# Altium project MC-IMX6Q-BOARD.PrjPCB
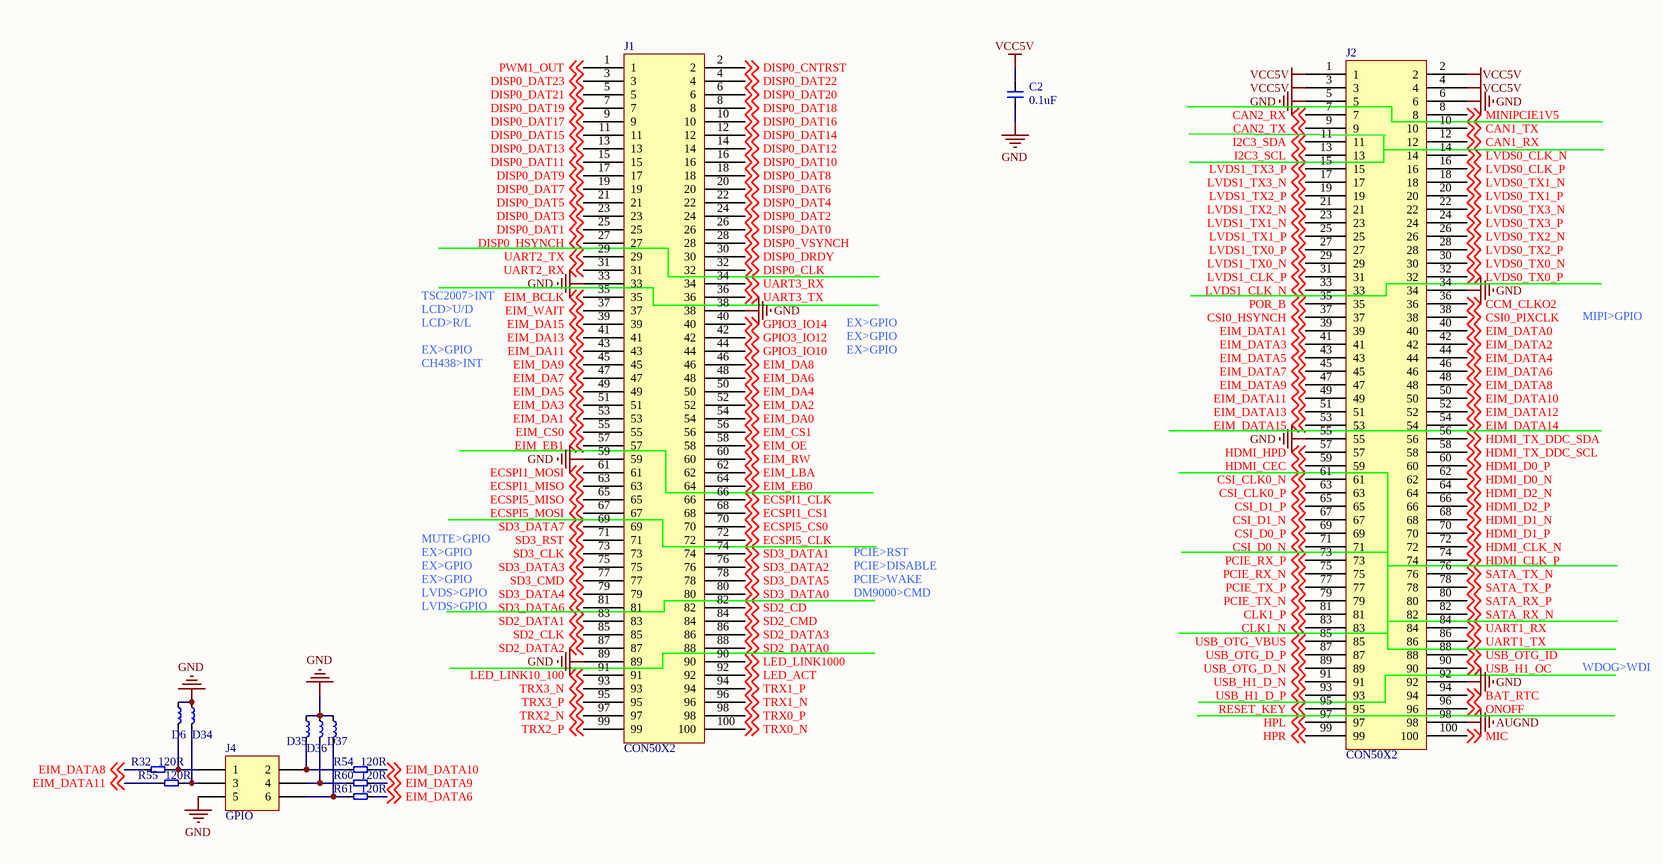
[diagram p0: 0.CONNECTOR.SchDoc]
10 sheets, 287 parts. Net scope: global (net labels, ports and power ports of the same name join across sheets).
Board file: IMX6.PcbDoc
Sheets:
  0.CONNECTOR.SchDoc
  1.POWER.SchDoc
  2.ETH.SchDoc
  3.UART.SchDoc
  4.CAN.SchDoc
  5.USB.SchDoc
  7.MINIPCIE.SchDoc
  10.LVDS.SchDoc
  11.EX-MODULE.SchDoc
  12.WTD&RTC.SchDoc

## Sheet 0.CONNECTOR.SchDoc
size A3

### Parts
(Parts that share a designator on the sheet are numbered #1, #2 ... from top to bottom, then left to right.)
C2  0.1uF  [0603C]
D6#1  ESD  [0603L]  (value not drawn)
D34  ESD  [0603L]  (value not drawn)
D35  ESD  [0603L]  (value not drawn)
D36  ESD  [0603L]  (value not drawn)
D37  ESD  [0603L]  (value not drawn)
J1  CON50X2  [IDC50X2-1.27MM_SMT]
J2  CON50X2  [IDC50X2-1.27MM_SMT]
J4  GPIO  [5557-6-small]
R32#1  120R  [0603R]
R54#1  120R  [0603R]
R55#1  120R  [0603R]
R60  120R  [0603R]
R61  120R  [0603R]

### Nets
AUGND: J2.98
GND: C2.2 D6#1.1 D34.1 D35.1 D36.1 D37.1 J1.33 J1.38 J1.59 J1.89 J2.5 J2.6 J2.34 J2.55 J2.92 J4.5
VCC5V: C2.1 J2.1 J2.2 J2.3 J2.4
BAT_RTC: J2.94 ; off-sheet BAT_RTC
CAN1_RX: J2.12 ; off-sheet CAN1_RX
CAN1_TX: J2.10 ; off-sheet CAN1_TX
CAN2_RX: J2.7 ; off-sheet CAN2_RX
CAN2_TX: J2.9 ; off-sheet CAN2_TX
CCM_CLKO2: J2.36 ; off-sheet CCM_CLKO2
CLK1_N: J2.83 ; off-sheet CLK1_N
CLK1_P: J2.81 ; off-sheet CLK1_P
CSI0_HSYNCH: J2.37 ; off-sheet CSI0_HSYNCH
CSI0_PIXCLK: J2.38 ; off-sheet CSI0_PIXCLK
CSI_CLK0_N: J2.61 ; off-sheet CSI_CLK0_N
CSI_CLK0_P: J2.63 ; off-sheet CSI_CLK0_P
CSI_D0_N: J2.71 ; off-sheet CSI_D0_N
CSI_D0_P: J2.69 ; off-sheet CSI_D0_P
CSI_D1_N: J2.67 ; off-sheet CSI_D1_N
CSI_D1_P: J2.65 ; off-sheet CSI_D1_P
DISP0_CLK: J1.32 ; off-sheet DISP0_CLK
DISP0_CNTRST: J1.2 ; off-sheet DISP0_CNTRST
DISP0_DAT0: J1.26 ; off-sheet DISP0_DAT0
DISP0_DAT1: J1.25 ; off-sheet DISP0_DAT1
DISP0_DAT2: J1.24 ; off-sheet DISP0_DAT2
DISP0_DAT3: J1.23 ; off-sheet DISP0_DAT3
DISP0_DAT4: J1.22 ; off-sheet DISP0_DAT4
DISP0_DAT5: J1.21 ; off-sheet DISP0_DAT5
DISP0_DAT6: J1.20 ; off-sheet DISP0_DAT6
DISP0_DAT7: J1.19 ; off-sheet DISP0_DAT7
DISP0_DAT8: J1.18 ; off-sheet DISP0_DAT8
DISP0_DAT9: J1.17 ; off-sheet DISP0_DAT9
DISP0_DAT10: J1.16 ; off-sheet DISP0_DAT10
DISP0_DAT11: J1.15 ; off-sheet DISP0_DAT11
DISP0_DAT12: J1.14 ; off-sheet DISP0_DAT12
DISP0_DAT13: J1.13 ; off-sheet DISP0_DAT13
DISP0_DAT14: J1.12 ; off-sheet DISP0_DAT14
DISP0_DAT15: J1.11 ; off-sheet DISP0_DAT15
DISP0_DAT16: J1.10 ; off-sheet DISP0_DAT16
DISP0_DAT17: J1.9 ; off-sheet DISP0_DAT17
DISP0_DAT18: J1.8 ; off-sheet DISP0_DAT18
DISP0_DAT19: J1.7 ; off-sheet DISP0_DAT19
DISP0_DAT20: J1.6 ; off-sheet DISP0_DAT20
DISP0_DAT21: J1.5 ; off-sheet DISP0_DAT21
DISP0_DAT22: J1.4 ; off-sheet DISP0_DAT22
DISP0_DAT23: J1.3 ; off-sheet DISP0_DAT23
DISP0_DRDY: J1.30 ; off-sheet DISP0_DRDY
DISP0_HSYNCH: J1.27 ; off-sheet DISP0_HSYNCH
DISP0_VSYNCH: J1.28 ; off-sheet DISP0_VSYNCH
ECSPI1_CLK: J1.66 ; off-sheet ECSPI1_CLK
ECSPI1_CS1: J1.68 ; off-sheet ECSPI1_CS1
ECSPI1_MISO: J1.63 ; off-sheet ECSPI1_MISO
ECSPI1_MOSI: J1.61 ; off-sheet ECSPI1_MOSI
ECSPI5_CLK: J1.72 ; off-sheet ECSPI5_CLK
ECSPI5_CS0: J1.70 ; off-sheet ECSPI5_CS0
ECSPI5_MISO: J1.65 ; off-sheet ECSPI5_MISO
ECSPI5_MOSI: J1.67 ; off-sheet ECSPI5_MOSI
EIM_BCLK: J1.35 ; off-sheet EIM_BCLK
EIM_CS0: J1.55 ; off-sheet EIM_CS0
EIM_CS1: J1.56 ; off-sheet EIM_CS1
EIM_DA0: J1.54 ; off-sheet EIM_DA0
EIM_DA1: J1.53 ; off-sheet EIM_DA1
EIM_DA2: J1.52 ; off-sheet EIM_DA2
EIM_DA3: J1.51 ; off-sheet EIM_DA3
EIM_DA4: J1.50 ; off-sheet EIM_DA4
EIM_DA5: J1.49 ; off-sheet EIM_DA5
EIM_DA6: J1.48 ; off-sheet EIM_DA6
EIM_DA7: J1.47 ; off-sheet EIM_DA7
EIM_DA8: J1.46 ; off-sheet EIM_DA8
EIM_DA9: J1.45 ; off-sheet EIM_DA9
EIM_DA11: J1.43 ; off-sheet EIM_DA11
EIM_DA13: J1.41 ; off-sheet EIM_DA13
EIM_DA15: J1.39 ; off-sheet EIM_DA15
EIM_DATA0: J2.40 ; off-sheet EIM_DATA0
EIM_DATA1: J2.39 ; off-sheet EIM_DATA1
EIM_DATA2: J2.42 ; off-sheet EIM_DATA2
EIM_DATA3: J2.41 ; off-sheet EIM_DATA3
EIM_DATA4: J2.44 ; off-sheet EIM_DATA4
EIM_DATA5: J2.43 ; off-sheet EIM_DATA5
EIM_DATA6: J2.46 R61.1 ; off-sheet EIM_DATA6
EIM_DATA7: J2.45 ; off-sheet EIM_DATA7
EIM_DATA8: J2.48 R32#1.2 ; off-sheet EIM_DATA8
EIM_DATA9: J2.47 R60.1 ; off-sheet EIM_DATA9
EIM_DATA10: J2.50 R54#1.1 ; off-sheet EIM_DATA10
EIM_DATA11: J2.49 R55#1.2 ; off-sheet EIM_DATA11
EIM_DATA12: J2.52 ; off-sheet EIM_DATA12
EIM_DATA13: J2.51 ; off-sheet EIM_DATA13
EIM_DATA14: J2.54 ; off-sheet EIM_DATA14
EIM_DATA15: J2.53 ; off-sheet EIM_DATA15
EIM_EB0: J1.64 ; off-sheet EIM_EB0
EIM_EB1: J1.57 ; off-sheet EIM_EB1
EIM_LBA: J1.62 ; off-sheet EIM_LBA
EIM_OE: J1.58 ; off-sheet EIM_OE
EIM_RW: J1.60 ; off-sheet EIM_RW
EIM_WAIT: J1.37 ; off-sheet EIM_WAIT
GPIO3_IO10: J1.44 ; off-sheet GPIO3_IO10
GPIO3_IO12: J1.42 ; off-sheet GPIO3_IO12
GPIO3_IO14: J1.40 ; off-sheet GPIO3_IO14
HDMI_CEC: J2.59 ; off-sheet HDMI_CEC
HDMI_CLK_N: J2.72 ; off-sheet HDMI_CLK_N
HDMI_CLK_P: J2.74 ; off-sheet HDMI_CLK_P
HDMI_D0_N: J2.62 ; off-sheet HDMI_D0_N
HDMI_D0_P: J2.60 ; off-sheet HDMI_D0_P
HDMI_D1_N: J2.68 ; off-sheet HDMI_D1_N
HDMI_D1_P: J2.70 ; off-sheet HDMI_D1_P
HDMI_D2_N: J2.64 ; off-sheet HDMI_D2_N
HDMI_D2_P: J2.66 ; off-sheet HDMI_D2_P
HDMI_HPD: J2.57 ; off-sheet HDMI_HPD
HDMI_TX_DDC_SCL: J2.58 ; off-sheet HDMI_TX_DDC_SCL
HDMI_TX_DDC_SDA: J2.56 ; off-sheet HDMI_TX_DDC_SDA
HPL: J2.97 ; off-sheet HPL
HPR: J2.99 ; off-sheet HPR
I2C3_SCL: J2.13 ; off-sheet I2C3_SCL
I2C3_SDA: J2.11 ; off-sheet I2C3_SDA
LED_ACT: J1.92 ; off-sheet LED_ACT
LED_LINK10_100: J1.91 ; off-sheet LED_LINK10_100
LED_LINK1000: J1.90 ; off-sheet LED_LINK1000
LVDS0_CLK_N: J2.14 ; off-sheet LVDS0_CLK_N
LVDS0_CLK_P: J2.16 ; off-sheet LVDS0_CLK_P
LVDS0_TX0_N: J2.30 ; off-sheet LVDS0_TX0_N
LVDS0_TX0_P: J2.32 ; off-sheet LVDS0_TX0_P
LVDS0_TX1_N: J2.18 ; off-sheet LVDS0_TX1_N
LVDS0_TX1_P: J2.20 ; off-sheet LVDS0_TX1_P
LVDS0_TX2_N: J2.26 ; off-sheet LVDS0_TX2_N
LVDS0_TX2_P: J2.28 ; off-sheet LVDS0_TX2_P
LVDS0_TX3_N: J2.22 ; off-sheet LVDS0_TX3_N
LVDS0_TX3_P: J2.24 ; off-sheet LVDS0_TX3_P
LVDS1_CLK_N: J2.33 ; off-sheet LVDS1_CLK_N
LVDS1_CLK_P: J2.31 ; off-sheet LVDS1_CLK_P
LVDS1_TX0_N: J2.29 ; off-sheet LVDS1_TX0_N
LVDS1_TX0_P: J2.27 ; off-sheet LVDS1_TX0_P
LVDS1_TX1_N: J2.23 ; off-sheet LVDS1_TX1_N
LVDS1_TX1_P: J2.25 ; off-sheet LVDS1_TX1_P
LVDS1_TX2_N: J2.21 ; off-sheet LVDS1_TX2_N
LVDS1_TX2_P: J2.19 ; off-sheet LVDS1_TX2_P
LVDS1_TX3_N: J2.17 ; off-sheet LVDS1_TX3_N
LVDS1_TX3_P: J2.15 ; off-sheet LVDS1_TX3_P
MIC: J2.100 ; off-sheet MIC
MINIPCIE1V5: J2.8 ; off-sheet MINIPCIE1V5
ONOFF: J2.96 ; off-sheet ONOFF
PCIE_RX_N: J2.75 ; off-sheet PCIE_RX_N
PCIE_RX_P: J2.73 ; off-sheet PCIE_RX_P
PCIE_TX_N: J2.79 ; off-sheet PCIE_TX_N
PCIE_TX_P: J2.77 ; off-sheet PCIE_TX_P
POR_B: J2.35 ; off-sheet POR_B
PWM1_OUT: J1.1 ; off-sheet PWM1_OUT
RESET_KEY: J2.95 ; off-sheet RESET_KEY  [project net NRST_E]
SATA_RX_N: J2.82 ; off-sheet SATA_RX_N
SATA_RX_P: J2.80 ; off-sheet SATA_RX_P
SATA_TX_N: J2.76 ; off-sheet SATA_TX_N
SATA_TX_P: J2.78 ; off-sheet SATA_TX_P
SD2_CD: J1.82 ; off-sheet SD2_CD
SD2_CLK: J1.85 ; off-sheet SD2_CLK
SD2_CMD: J1.84 ; off-sheet SD2_CMD
SD2_DATA0: J1.88 ; off-sheet SD2_DATA0
SD2_DATA1: J1.83 ; off-sheet SD2_DATA1
SD2_DATA2: J1.87 ; off-sheet SD2_DATA2
SD2_DATA3: J1.86 ; off-sheet SD2_DATA3
SD3_CLK: J1.73 ; off-sheet SD3_CLK  [project net BG_EN]
SD3_CMD: J1.77 ; off-sheet SD3_CMD
SD3_DATA0: J1.80 ; off-sheet SD3_DATA0
SD3_DATA1: J1.74 ; off-sheet SD3_DATA1
SD3_DATA2: J1.76 ; off-sheet SD3_DATA2
SD3_DATA3: J1.75 ; off-sheet SD3_DATA3  [project net BG_PWM]
SD3_DATA4: J1.79 ; off-sheet SD3_DATA4
SD3_DATA5: J1.78 ; off-sheet SD3_DATA5
SD3_DATA6: J1.81 ; off-sheet SD3_DATA6
SD3_DATA7: J1.69 ; off-sheet SD3_DATA7
SD3_RST: J1.71 ; off-sheet SD3_RST  [project net AU_MUTE]
TRX0_N: J1.100 ; off-sheet TRX0_N
TRX0_P: J1.98 ; off-sheet TRX0_P
TRX1_N: J1.96 ; off-sheet TRX1_N
TRX1_P: J1.94 ; off-sheet TRX1_P
TRX2_N: J1.97 ; off-sheet TRX2_N
TRX2_P: J1.99 ; off-sheet TRX2_P
TRX3_N: J1.93 ; off-sheet TRX3_N
TRX3_P: J1.95 ; off-sheet TRX3_P
UART1_RX: J2.84 ; off-sheet UART1_RX
UART1_TX: J2.86 ; off-sheet UART1_TX
UART2_RX: J1.31 ; off-sheet UART2_RX
UART2_TX: J1.29 ; off-sheet UART2_TX
UART3_RX: J1.34 ; off-sheet UART3_RX
UART3_TX: J1.36 ; off-sheet UART3_TX
USB_H1_D_N: J2.91 ; off-sheet USB_H1_D_N
USB_H1_D_P: J2.93 ; off-sheet USB_H1_D_P
USB_H1_OC: J2.90 ; off-sheet USB_H1_OC
USB_OTG_D_N: J2.89 ; off-sheet USB_OTG_D_N
USB_OTG_D_P: J2.87 ; off-sheet USB_OTG_D_P
USB_OTG_ID: J2.88 ; off-sheet USB_OTG_ID
USB_OTG_VBUS: J2.85 ; off-sheet USB_OTG_VBUS
NetD6#1_2: D6#1.2 J4.1 R32#1.1
NetD34_2: D34.2 J4.3 R55#1.1
NetD35_2: D35.2 J4.2 R54#1.2
NetD36_2: D36.2 J4.4 R60.2
NetD37_2: D37.2 J4.6 R61.2

### Notes on the sheet
- TSC2007>INT
- LCD>U/D
- LCD>R/L
- EX>GPIO
- MIPI>GPIO
- CH438>INT
- LVDS>GPIO
- MUTE>GPIO
- DM9000>CMD
- PCIE>WAKE
- PCIE>DISABLE
- PCIE>RST
- WDOG>WDI

### Library data of the parts
C2 = 电容
D6#1 D34-D37 = 电感
J1 J2 = CON50X2: ASTRON B2B Connector
J4 = Header 3X2: Header, 3-Pin, Dual row; LatestRevisionDate: 17-Jul-2002; LatestRevisionNote: Re-released for DXP Platform.; Publisher: Altium Limited
R32#1 R54#1 R55#1 R60 R61 = 电阻

## Sheet 1.POWER.SchDoc
size A4
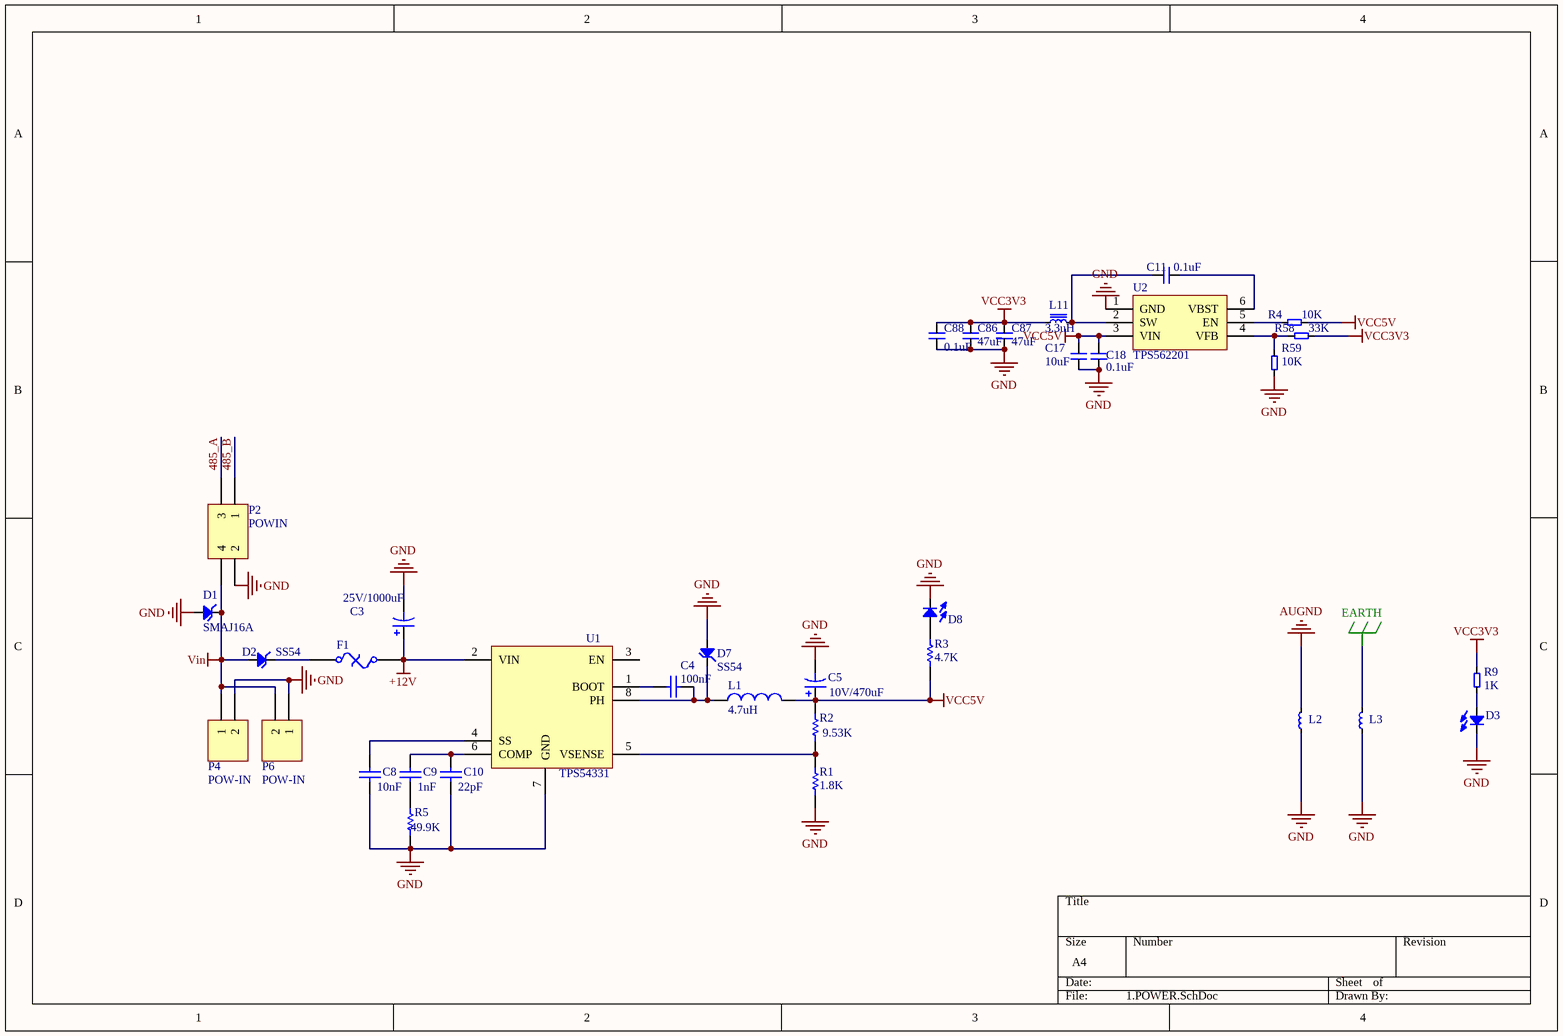
[diagram p1: 1.POWER.SchDoc]

### Parts
C3  value 25V/1000uF  [C10-SMD]  (hidden comment: 1000uF/25V)
C4  100nF  [0603C]
C5  10V/470uF  [C8x10-SMD]
C8  10nF  [0603C]
C9  1nF  [0603C]
C10  22pF  [0603C]
C11  0.1uF  [0603C]
C17  10uF  [0603C]
C18  0.1uF  [0603C]
C86  47uF  [C1206]
C87  47uF  [C1206]
C88  0.1uF  [0603C]
D1  SMAJ16A  [SMA]
D2  SS54  [SMA]
D3  发光二极管  [0603D]  (value not drawn)
D7  SS54  [SMA]
D8  发光二极管  [0603D]  (value not drawn)
F1  2A  FUSE  [1812F]  (value not drawn)
L1  4.7uH  [L-6045]
L2  电感  [0805L]  (value not drawn)
L3  电感  [0805L]  (value not drawn)
L11  3.3uH  [L4030]
P2  POWIN  [5569]
P4  POW-IN  [VH3.96-2P-SMT]
P6  POW-IN  [DC-5525]
R1  1.8K  [0603R]
R2  9.53K  [0603R]
R3  value 4.7K  [0603R]  (hidden comment: 1.5K)
R4  10K  [0603R]
R5  49.9K  [0603R]
R9  1K  [0603R]
R58  33K  [0603R]
R59  10K  [0603R]
U1  TPS54331  [SOP8-POW]
U2  TPS562201  [SOT23-6-DC]

### Nets
+12V: C3.1 F1.2 U1.2(VIN)
AUGND: L2.2
EARTH: L3.2 P4.0
GND: C3.2 C5.2 C8.2 C10.1 C17.2 C18.2 C86.2 C87.2 C88.2 D1.A D3.K D7.A D8.K L2.1 L3.1 P2.2 P4.2 P6.1 R1.1 R5.1 R59.1 U1.7(GND) U1.9 U2.1(GND)
VCC3V3: C86.1 C87.1 C88.1 L11.1 R9.2 R58.1
VCC5V: C5.1 C17.1 C18.1 L1.2 R2.2 R3.1 R4.1 U2.3(VIN)
Vin: D1.K D2.A P2.4 P4.1 P6.2
485_A: P2.3
485_B: P2.1
NetC4_1: C4.1 D7.K L1.1 U1.8(PH)
NetC4_2: C4.2 U1.1(BOOT)
NetC8_1: C8.1 U1.4(SS)
NetC9_1: C9.1 R5.2
NetC9_2: C9.2 C10.2 U1.6(COMP)
NetC11_1: C11.1 L11.2 U2.2(SW)
NetC11_2: C11.2 U2.6(VBST)
NetD2_K: D2.K F1.1
NetD3_A: D3.A R9.1
NetD8_A: D8.A R3.2
NetR1_2: R1.2 R2.1 U1.5(VSENSE)
NetR4_2: R4.2 U2.5(EN)
NetR58_2: R58.2 R59.2 U2.4(VFB)

Not connected (* = marked no-connect by the designer): U1 3(EN)

### Library data of the parts
C3 C5 = Cap Pol3: Polarized Capacitor (Surface Mount); Published: 8-Jun-2000; LatestRevisionDate: 17-Jul-2002; LatestRevisionNote: Re-released for DXP Platform.; PackageReference: C0805; Publisher: Altium Limited
  C5: Value: 10V/470uF
C4 C9 C10 = Cap: 电容; Published: 8-Jun-2000; LatestRevisionDate: 17-Jul-2002; LatestRevisionNote: Re-released for DXP Platform.; PackageReference: RAD-0.3; Publisher: Altium Limited
  C4: Value: 100nf
  C9: PackageDescription: Radial Cap, Thru-Hole; 2 Leads; 0.3 in Pin Spacing; Value: 1nF
  C10: PackageDescription: Radial Cap, Thru-Hole; 2 Leads; 0.3 in Pin Spacing; Value: 22pF
C8 = Cap: 电容; Value: 103; Published: 8-Jun-2000; LatestRevisionDate: 17-Jul-2002; LatestRevisionNote: Re-released for DXP Platform.; PackageReference: RAD-0.3; Publisher: Altium Limited; PackageDescription: Radial Cap, Thru-Hole; 2 Leads; 0.3 in Pin Spacing
C11 C17 C18 C86-C88 = 电容
D1 = SS24: TVS; DIODES: *
D2 D7 = SS24: 肖特基二极管; DIODES: *
F1 = Fuse Thermal: Thermal Fuse; Published: 24-Mar-1999; LatestRevisionDate: 17-Jul-2002; LatestRevisionNote: Re-released for DXP Platform.; PackageReference: PIN-W2/E2.8; Publisher: Altium Limited
L1 = Inductor: Code_IEC: 1005; Published: 8-Jun-2000; LatestRevisionDate: 17-Jul-2002; LatestRevisionNote: Re-released for DXP Platform.; PackageReference: 0402-A; Publisher: Altium Limited; Code_JEITA: 0402; Value: 4.7uH
L11 = 功率电感
P2 = Header 2X2: Header, 2-Pin, Dual row; LatestRevisionDate: 17-Jul-2002; LatestRevisionNote: Re-released for DXP Platform.; Publisher: Altium Limited
P4 P6 = Header 2: Header, 2-Pin; LatestRevisionDate: 17-Jul-2002; LatestRevisionNote: Re-released for DXP Platform.; Publisher: Altium Limited
R1 R5 = Res Semi: 电阻; Published: 8-Jun-2000; LatestRevisionDate: 17-Jul-2002; LatestRevisionNote: Re-released for DXP Platform.; PackageReference: AXIAL-0.5; Publisher: Altium Limited; PackageDescription: Axial Device, Thru-Hole; 2 Leads; 0.5 in Pin Spacing
  R1: Value: 1.8K
  R5: Value: 49.9K
R2 = Res Semi: 电阻; Value: 9.53K(5.03); Published: 8-Jun-2000; LatestRevisionDate: 17-Jul-2002; LatestRevisionNote: Re-released for DXP Platform.; PackageReference: AXIAL-0.5; Publisher: Altium Limited; PackageDescription: Axial Device, Thru-Hole; 2 Leads; 0.5 in Pin Spacing
R3 = Res1: 电阻; Published: 8-Jun-2000; LatestRevisionDate: 17-Jul-2002; LatestRevisionNote: Re-released for DXP Platform.; PackageReference: AXIAL-0.3; Publisher: Altium Limited
R4 R9 R58 R59 = 电阻

## Sheet 2.ETH.SchDoc
size A3
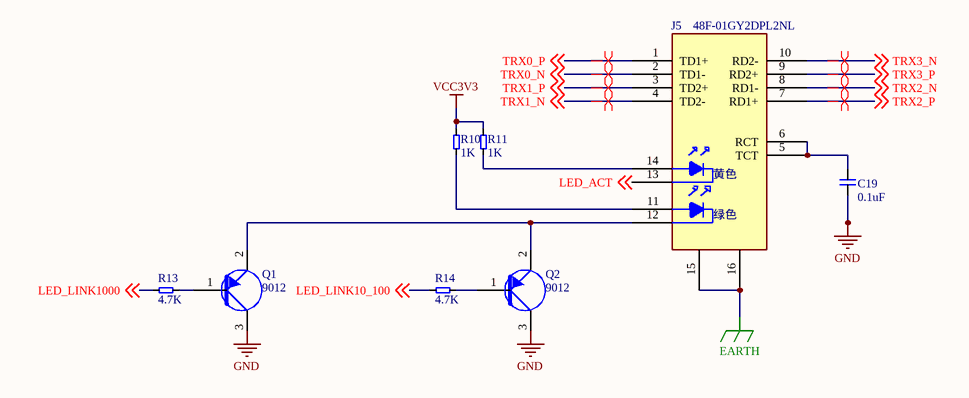
[diagram p2: 2.ETH.SchDoc]

### Parts
C19  0.1uF  [0603C]
J5  48F-01GY2DPL2NL  [RJ45C-48F-01GY2DPL2NL]
Q1  9012  [SOT-23-PMOS]
Q2  9012  [SOT-23-PMOS]
R10  1K  [0603R]
R11  1K  [0603R]
R13  4.7K  [0603R]
R14  4.7K  [0603R]

### Nets
EARTH: J5.15 J5.16
GND: C19.2 Q1.3 Q2.3
VCC3V3: R10.2 R11.2
LED_ACT: J5.13 ; off-sheet LED_ACT
LED_LINK10_100: R14.2 ; off-sheet LED_LINK10_100
LED_LINK1000: R13.2 ; off-sheet LED_LINK1000
TRX0_N: J5.2(TD1-) ; off-sheet TRX0_N
TRX0_P: J5.1(TD1+) ; off-sheet TRX0_P
TRX1_N: J5.4(TD2-) ; off-sheet TRX1_N
TRX1_P: J5.3(TD2+) ; off-sheet TRX1_P
TRX2_N: J5.8(RD1-) ; off-sheet TRX2_N
TRX2_P: J5.7(RD1+) ; off-sheet TRX2_P
TRX3_N: J5.10(RD2-) ; off-sheet TRX3_N
TRX3_P: J5.9(RD2+) ; off-sheet TRX3_P
NetC19_1: C19.1 J5.5(TCT) J5.6(RCT)
NetJ5_11: J5.11 R10.1
NetJ5_12: J5.12 Q1.2 Q2.2
NetJ5_14: J5.14 R11.1
NetQ1_1: Q1.1 R13.1
NetQ2_1: Q2.1 R14.1

### Layout directives
differential pair: TRX0_N, TRX0_P, TRX1_N, TRX1_P, TRX2_N, TRX2_P, TRX3_N, TRX3_P

### Notes on the sheet
- (in symbol 48F-01GY2DPL2NL) 黄色; 绿色

### Library data of the parts
C19 = 电容
R10 R11 R13 R14 = 电阻

## Sheet 3.UART.SchDoc
size A2
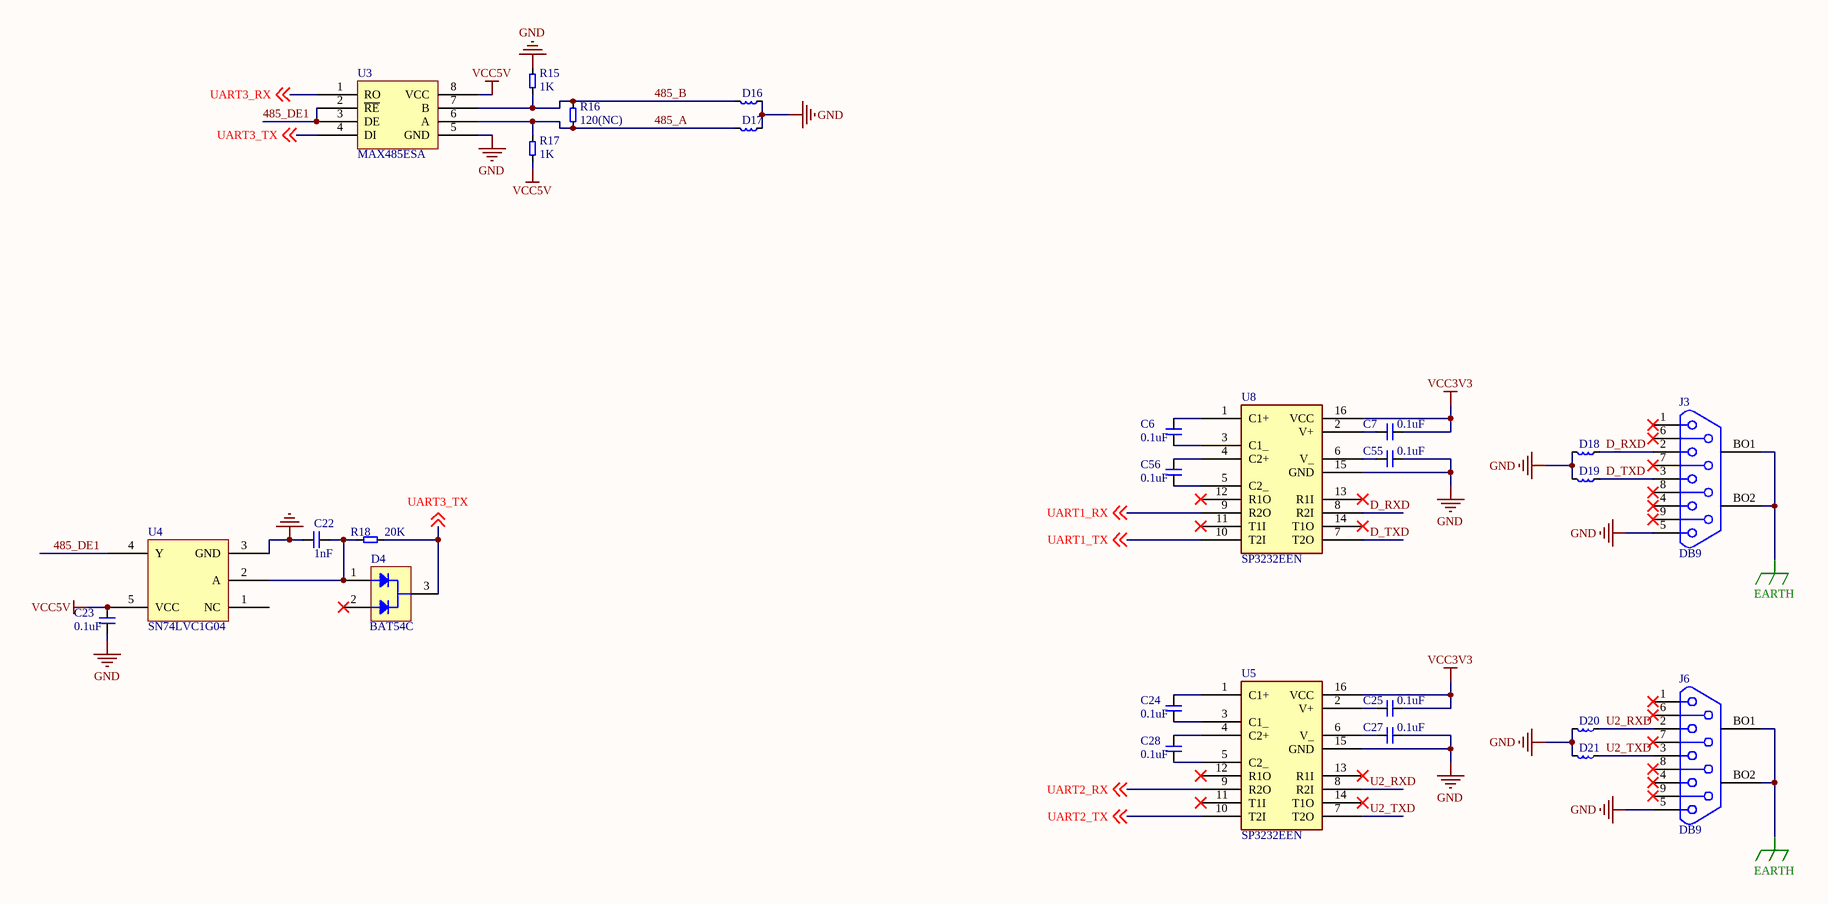
[diagram p3: 3.UART.SchDoc]

### Parts
C6  0.1uF  [0603C]
C7  0.1uF  [0603C]
C22  1nF  [0603C]
C23  0.1uF  [0603C]
C24  0.1uF  [0603C]
C25  0.1uF  [0603C]
C27  0.1uF  [0603C]
C28  0.1uF  [0603C]
C55  0.1uF  [0603C]
C56  0.1uF  [0603C]
D4  BAT54C  [SOT-23]
D16  ESD  [0603L]  (value not drawn)
D17  ESD  [0603L]  (value not drawn)
D18  ESD  [0603L]  (value not drawn)
D19  ESD  [0603L]  (value not drawn)
D20  ESD  [0603L]  (value not drawn)
D21  ESD  [0603L]  (value not drawn)
J3  DB9  [DB-9/M]
J6  DB9  [DB-9/M]
R15  1K  [0603R]
R16  120(NC)  [0603R]
R17  1K  [0603R]
R18  20K  [0603R]
U3  MAX485ESA  [SOP8-1.27]
U4  SN74LVC1G04  [SOT23-5N]
U5  SP3232EEN  [SOIC16-1.27]
U8  SP3232EEN  [SOIC16-1.27]

### Nets
EARTH: J3.BO1 J3.BO2 J6.BO1 J6.BO2
GND: C22.1 C23.2 C27.2 C55.2 D16.1 D17.1 D18.2 D19.2 D20.2 D21.2 J3.5 J6.5 R15.2 U3.5(GND) U4.3(GND) U5.15(GND) U8.15(GND)
VCC3V3: C7.2 C25.2 U5.16(VCC) U8.16(VCC)
VCC5V: C23.1 R17.1 U3.8(VCC) U4.5(VCC)
485_A: D17.2 R16.1 R17.2 U3.6(A)
485_B: D16.2 R15.1 R16.2 U3.7(B)
485_DE1: U3.2(~{RE}) U3.3(DE) U4.4(Y)
D_RXD: D18.1 J3.2 U8.8(R2I)
D_TXD: D19.1 J3.3 U8.7(T2O)
U2_RXD: D20.1 J6.2 U5.8(R2I)
U2_TXD: D21.1 J6.3 U5.7(T2O)
UART1_RX: U8.9(R2O) ; off-sheet UART1_RX
UART1_TX: U8.10(T2I) ; off-sheet UART1_TX
UART2_RX: U5.9(R2O) ; off-sheet UART2_RX
UART2_TX: U5.10(T2I) ; off-sheet UART2_TX
UART3_RX: U3.1(RO) ; off-sheet UART3_RX
UART3_TX: D4.3 R18.2 U3.4(DI) ; off-sheet UART3_TX
NetC6_1: C6.1 U8.1(C1+)
NetC6_2: C6.2 U8.3(C1_)
NetC7_1: C7.1 U8.2(V+)
NetC22_2: C22.2 D4.1 R18.1 U4.2(A)
NetC24_1: C24.1 U5.1(C1+)
NetC24_2: C24.2 U5.3(C1_)
NetC25_1: C25.1 U5.2(V+)
NetC27_1: C27.1 U5.6(V_)
NetC28_1: C28.1 U5.4(C2+)
NetC28_2: C28.2 U5.5(C2_)
NetC55_1: C55.1 U8.6(V_)
NetC56_1: C56.1 U8.4(C2+)
NetC56_2: C56.2 U8.5(C2_)

Not connected (* = marked no-connect by the designer): D4 2*; J3 1* 4* 6* 7* 8* 9*; J6 1* 4* 6* 7* 8* 9*; U4 1(NC); U5 11(T1I)* 12(R1O)* 13(R1I)* 14(T1O)*; U8 11(T1I)* 12(R1O)* 13(R1I)* 14(T1O)*

### Library data of the parts
C6 C7 C22-C25 C27 C28 C55 C56 = 电容
D4 = BAT54C: SCHOTTKY DIODE
D16-D21 = 电感
R15-R18 = 电阻
U5 U8 = MAX232ESE: Text Field1: MAXIM; Text Field2: RS232; MAXIM: *
U3 = MAX485ESA: MAXIM: *

## Sheet 4.CAN.SchDoc
size A4
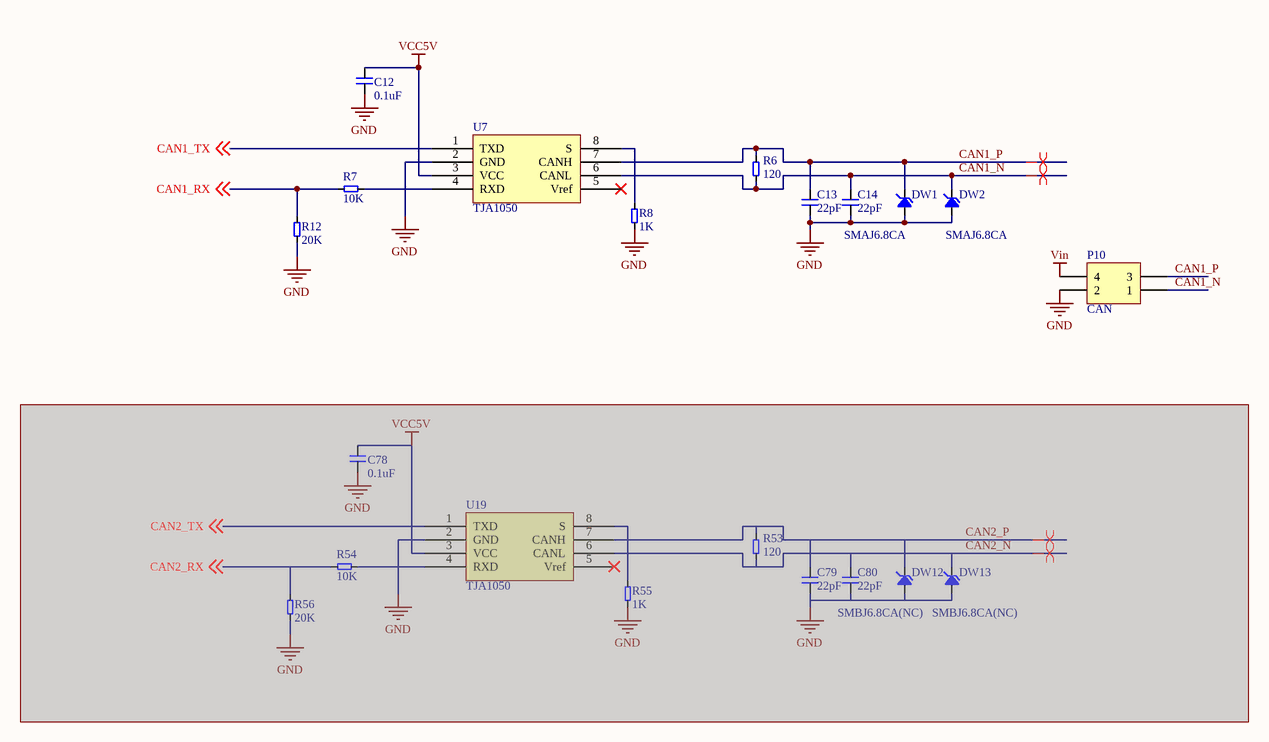
[diagram p4: 4.CAN.SchDoc]

### Parts
(Parts that share a designator on the sheet are numbered #1, #2 ... from top to bottom, then left to right.)
C12  0.1uF  [0603C]
C13  22pF  [0603C]
C14  22pF  [0603C]
C78#1  0.1uF  [0603C]  (masked out: inside a compile mask, not in the netlist)
C79#1  22pF  [0603C]  (masked out: inside a compile mask, not in the netlist)
C80#1  22pF  [0603C]  (masked out: inside a compile mask, not in the netlist)
DW1  SMAJ6.8CA  [SMA]
DW2  SMAJ6.8CA  [SMA]
DW12  SMBJ6.8CA(NC)  [SMA]  (masked out: inside a compile mask, not in the netlist)
DW13  SMBJ6.8CA(NC)  [SMA]  (masked out: inside a compile mask, not in the netlist)
P10  CAN  [5569]
R6  120  [0603R]
R7  10K  [0603R]
R8  1K  [0603R]
R12  20K  [0603R]
R53#1  120  [0603R]  (masked out: inside a compile mask, not in the netlist)
R54#2  10K  [0603R]  (masked out: inside a compile mask, not in the netlist)
R55#2  1K  [0603R]  (masked out: inside a compile mask, not in the netlist)
R56#1  20K  [0603R]  (masked out: inside a compile mask, not in the netlist)
U7#1  TJA1050  [SOP8-1.27]
U19  TJA1050  [SOP8-1.27]  (masked out: inside a compile mask, not in the netlist)

### Nets
GND: C12.2 C13.1 C14.1 DW1.A DW2.A P10.2 R8.1 R12.1 U7#1.2(GND)
VCC5V: C12.1 U7#1.3(VCC)
Vin: P10.4
CAN1_N: C14.2 DW2.K P10.1 R6.1 U7#1.6(CANL)
CAN1_P: C13.2 DW1.K P10.3 R6.2 U7#1.7(CANH)
CAN1_RX: R7.1 R12.2 ; off-sheet CAN1_RX
CAN1_TX: U7#1.1(TXD) ; off-sheet CAN1_TX
NetR7_2: R7.2 U7#1.4(RXD)
NetR8_2: R8.2 U7#1.8(S)

Not connected (* = marked no-connect by the designer): U7#1 5(Vref)*

### Layout directives
differential pair: (no net found under the mark), CAN1_N, CAN1_P

### Library data of the parts
C12-C14 C78#1 C79#1 C80#1 = 电容
DW1 DW2 DW12 DW13 = 肖特基二极管
P10 = Header 2X2: Header, 2-Pin, Dual row; LatestRevisionDate: 17-Jul-2002; LatestRevisionNote: Re-released for DXP Platform.; Publisher: Altium Limited
R6-R8 R12 R53#1 R54#2 R55#2 R56#1 = 电阻

## Sheet 5.USB.SchDoc
size A3
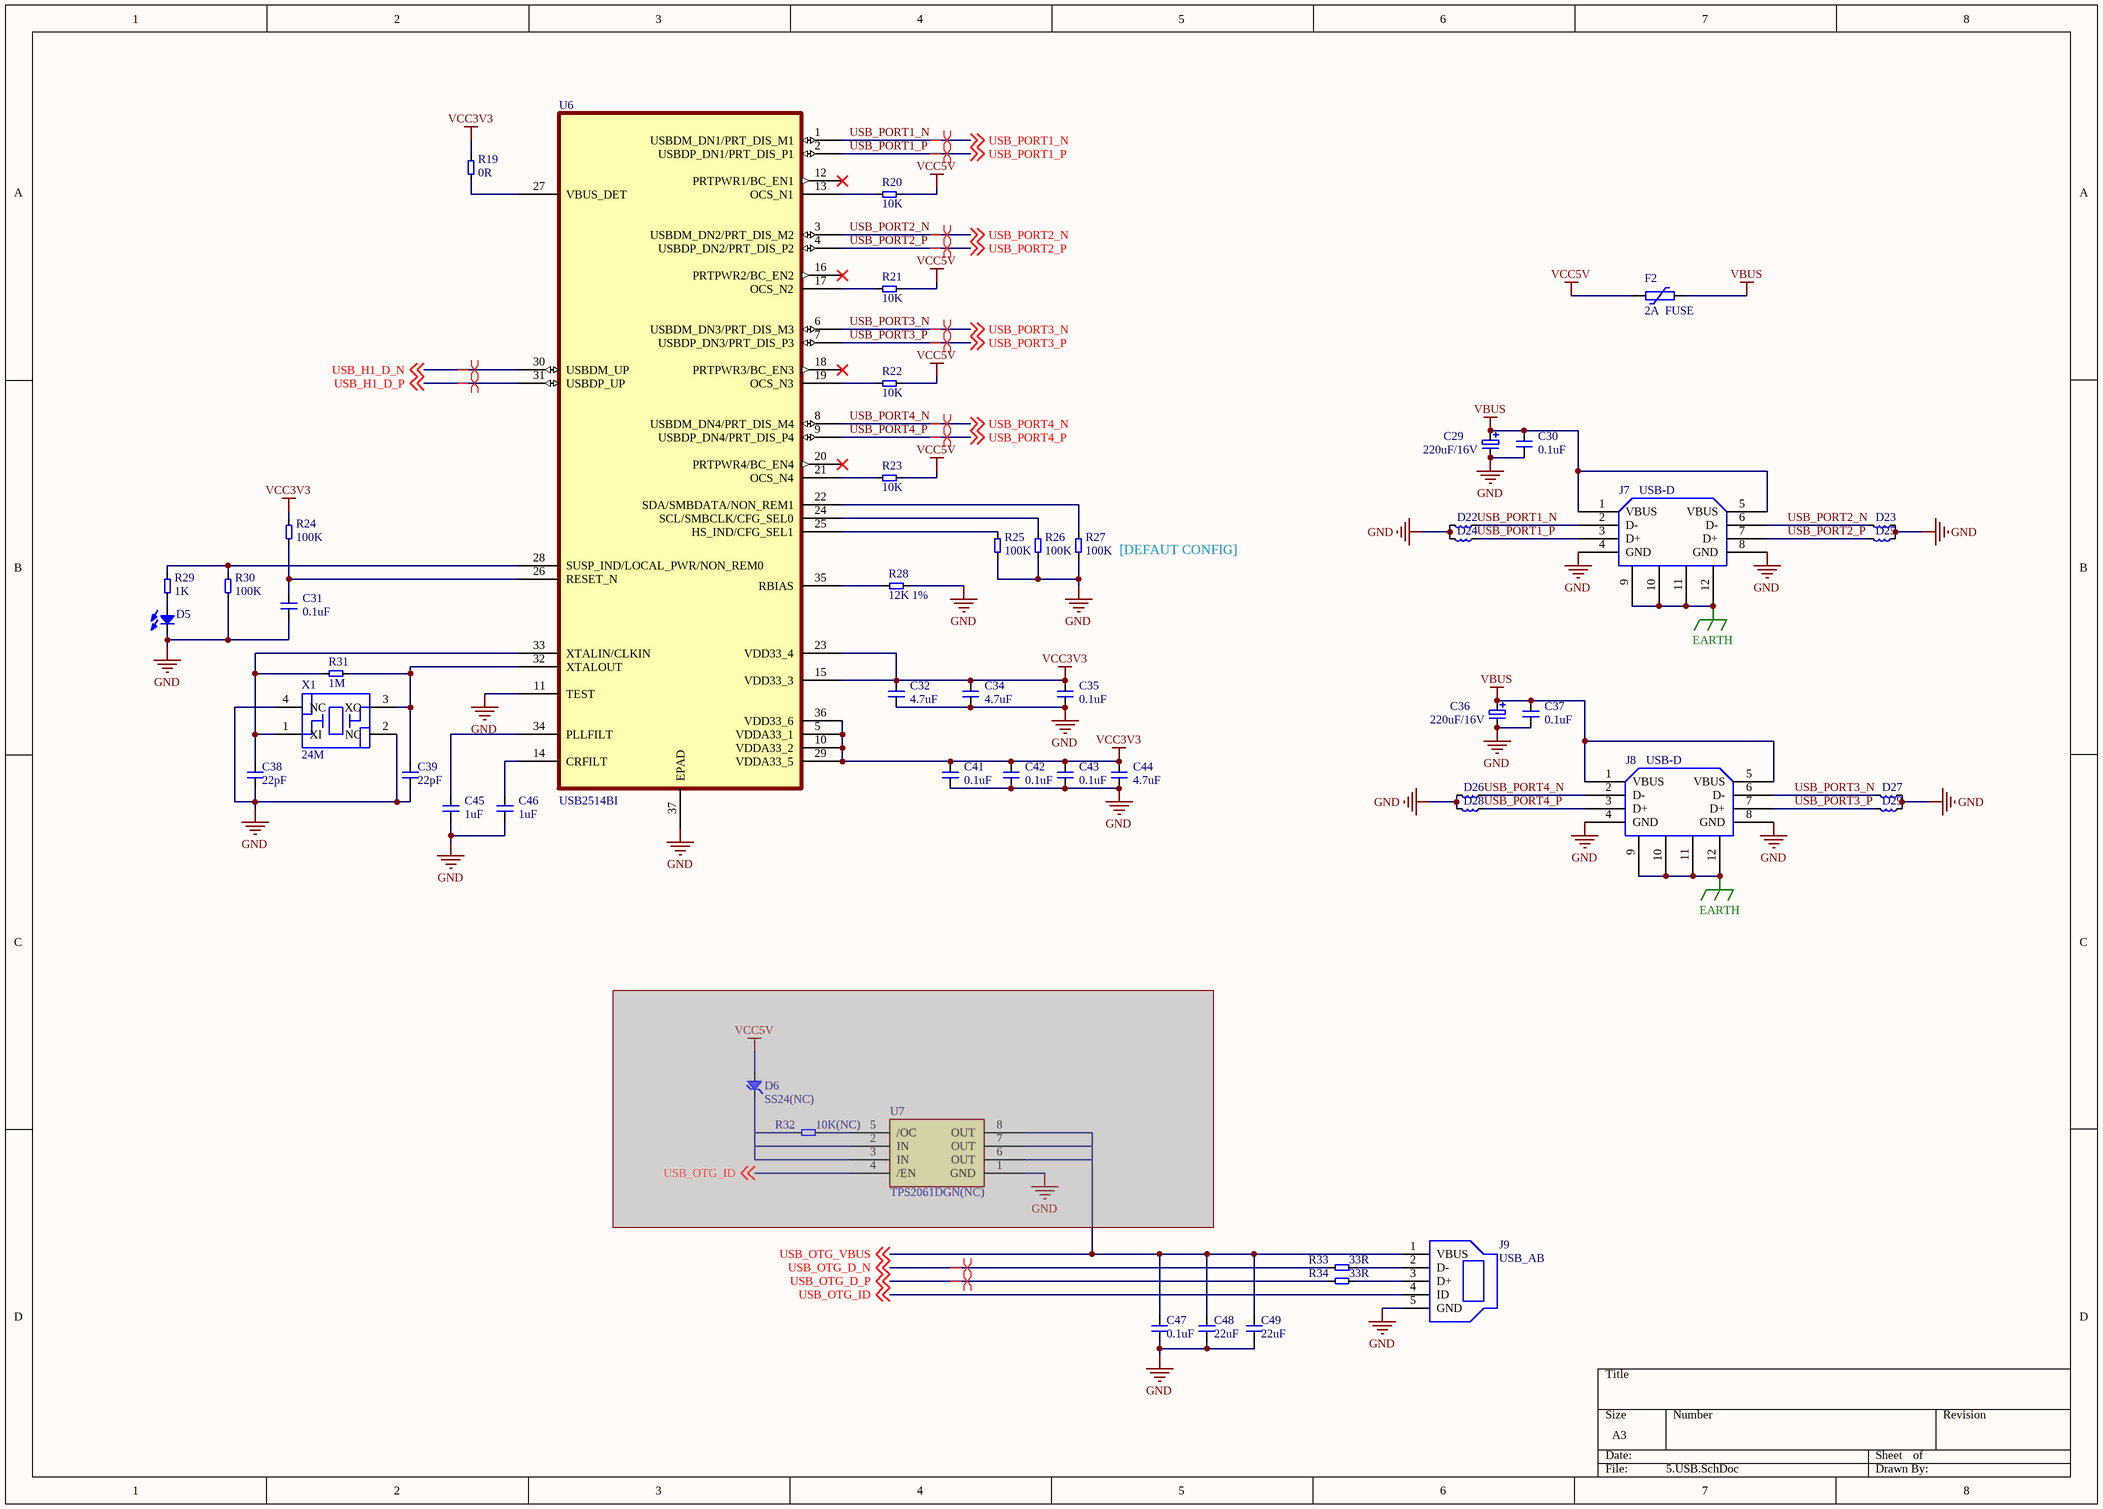
[diagram p5: 5.USB.SchDoc]

### Parts
(Parts that share a designator on the sheet are numbered #1, #2 ... from top to bottom, then left to right.)
C29  220uF/16V  [C6.3x5.4-SMD]
C30  0.1uF  [0603C]
C31  0.1uF  [0603C]
C32  4.7uF  [0603C]
C34  4.7uF  [0603C]
C35  0.1uF  [0603C]
C36  220uF/16V  [C6.3x5.4-SMD]
C37  0.1uF  [0603C]
C38  22pF  [0603C]
C39  22pF  [0603C]
C41  0.1uF  [0603C]
C42  0.1uF  [0603C]
C43  0.1uF  [0603C]
C44  4.7uF  [0603C]
C45  1uF  [0603C]
C46  1uF  [0603C]
C47  0.1uF  [0603C]
C48  22uF  [0603C]
C49  22uF  [0603C]
D5  发光二极管  [0603D]  (value not drawn)
D6#2  SS24(NC)  [SMA]  (masked out: inside a compile mask, not in the netlist)
D22  ESD  [0603L]  (value not drawn)
D23  ESD  [0603L]  (value not drawn)
D24  ESD  [0603L]  (value not drawn)
D25  ESD  [0603L]  (value not drawn)
D26  ESD  [0603L]  (value not drawn)
D27  ESD  [0603L]  (value not drawn)
D28  ESD  [0603L]  (value not drawn)
D29  ESD  [0603L]  (value not drawn)
F2  2A  FUSE  [1812F]
J7  USB-D  [USB-D]
J8  USB-D  [USB-D]
J9  USB_AB  [MINI USB B]
R19  0R  [0603R]
R20  10K  [0603R]
R21  10K  [0603R]
R22  10K  [0603R]
R23  10K  [0603R]
R24  100K  [0603R]
R25  100K  [0603R]
R26  100K  [0603R]
R27  100K  [0603R]
R28  12K 1%  [0603R]
R29  1K  [0603R]
R30  100K  [0603R]
R31  1M  [0603R]
R32#2  10K(NC)  [0603R]  (masked out: inside a compile mask, not in the netlist)
R33  33R  [0603R]
R34  33R  [0603R]
U6  USB2514BI  [QFN-36]
U7#2  TPS2061DGN(NC)  [MSOP-8]  (masked out: inside a compile mask, not in the netlist)
X1  24M  [OSC4-3225]

### Nets
EARTH: J7.9 J7.10 J7.11 J7.12 J8.9 J8.10 J8.11 J8.12 J9.6(9) J9.7(9) J9.8(9) J9.9
GND: C29.2 C30.1 C31.1 C32.1 C34.1 C35.1 C36.2 C37.1 C38.1 C39.1 C41.1 C42.1 C43.1 C44.1 C45.1 C46.1 C47.1 C48.1 C49.1 D5.K D22.2 D23.1 D24.2 D25.1 D26.2 D27.1 D28.2 D29.1 J7.4(GND) J7.8(GND) J8.4(GND) J8.8(GND) J9.5(GND) R25.2 R26.2 R27.2 R28.1 R30.2 U6.11(TEST) U6.37(EPAD) X1.2(NC) X1.4(NC)
VBUS: C29.1 C30.2 C36.1 C37.2 F2.2 J7.1(VBUS) J7.5(VBUS) J8.1(VBUS) J8.5(VBUS)
VCC3V3: C32.2 C34.2 C35.2 C41.2 C42.2 C43.2 C44.2 R19.2 R24.1 U6.5(VDDA33_1) U6.10(VDDA33_2) U6.15(VDD33_3) U6.23(VDD33_4) U6.29(VDDA33_5) U6.36(VDD33_6)
VCC5V: F2.1 R20.1 R21.1 R22.1 R23.1
USB_H1_D_N: U6.30(USBDM_UP) ; off-sheet USB_H1_D_N
USB_H1_D_P: U6.31(USBDP_UP) ; off-sheet USB_H1_D_P
USB_OTG_D_N: R33.2 ; off-sheet USB_OTG_D_N
USB_OTG_D_P: R34.2 ; off-sheet USB_OTG_D_P
USB_OTG_ID: J9.4(ID) ; off-sheet USB_OTG_ID
USB_OTG_VBUS: C47.2 C48.2 C49.2 J9.1(VBUS) ; off-sheet USB_OTG_VBUS
USB_PORT1_N: D22.1 J7.2(D-) U6.1(USBDM_DN1/PRT_DIS_M1) ; off-sheet USB_PORT1_N
USB_PORT1_P: D24.1 J7.3(D+) U6.2(USBDP_DN1/PRT_DIS_P1) ; off-sheet USB_PORT1_P
USB_PORT2_N: D23.2 J7.6(D-) U6.3(USBDM_DN2/PRT_DIS_M2) ; off-sheet USB_PORT2_N
USB_PORT2_P: D25.2 J7.7(D+) U6.4(USBDP_DN2/PRT_DIS_P2) ; off-sheet USB_PORT2_P
USB_PORT3_N: D27.2 J8.6(D-) U6.6(USBDM_DN3/PRT_DIS_M3) ; off-sheet USB_PORT3_N
USB_PORT3_P: D29.2 J8.7(D+) U6.7(USBDP_DN3/PRT_DIS_P3) ; off-sheet USB_PORT3_P
USB_PORT4_N: D26.1 J8.2(D-) U6.8(USBDM_DN4/PRT_DIS_M4) ; off-sheet USB_PORT4_N
USB_PORT4_P: D28.1 J8.3(D+) U6.9(USBDP_DN4/PRT_DIS_P4) ; off-sheet USB_PORT4_P
NetC31_2: C31.2 R24.2 U6.26(RESET_N)
NetC38_2: C38.2 R31.1 U6.33(XTALIN/CLKIN) X1.1(XI)
NetC39_2: C39.2 R31.2 U6.32(XTALOUT) X1.3(XO)
NetC45_2: C45.2 U6.34(PLLFILT)
NetC46_2: C46.2 U6.14(CRFILT)
NetD5_A: D5.A R29.1
NetJ9_2: J9.2(D-) R33.1
NetJ9_3: J9.3(D+) R34.1
NetR19_1: R19.1 U6.27(VBUS_DET)
NetR20_2: R20.2 U6.13(OCS_N1)
NetR21_2: R21.2 U6.17(OCS_N2)
NetR22_2: R22.2 U6.19(OCS_N3)
NetR23_2: R23.2 U6.21(OCS_N4)
NetR25_1: R25.1 U6.25(HS_IND/CFG_SEL1)
NetR26_1: R26.1 U6.24(SCL/SMBCLK/CFG_SEL0)
NetR27_1: R27.1 U6.22(SDA/SMBDATA/NON_REM1)
NetR28_2: R28.2 U6.35(RBIAS)
NetR29_2: R29.2 R30.1 U6.28(SUSP_IND/LOCAL_PWR/NON_REM0)

Not connected (* = marked no-connect by the designer): U6 12(PRTPWR1/BC_EN1)* 16(PRTPWR2/BC_EN2)* 18(PRTPWR3/BC_EN3)* 20(PRTPWR4/BC_EN4)*

### Layout directives
differential pair: USB_H1_D_N, USB_H1_D_P, USB_OTG_D_N, USB_OTG_D_P, USB_PORT1_N, USB_PORT1_P, USB_PORT2_N, USB_PORT2_P, USB_PORT3_N, USB_PORT3_P, USB_PORT4_N, USB_PORT4_P

### Notes on the sheet
- (near R27) [DEFAUT CONFIG]

### Library data of the parts
C29 C36 = 直插电解电容
C30-C32 C34 C35 C37-C39 C41-C49 = 电容
D6#2 = SS24: DIODES: *
D22-D29 = 电感
F2 = FUSE: 贴片自恢复保险丝
J7 J8 = USB-D: USB DOUBLE PORTS
J9 = USB_AB: 小USB插痤
R19-R31 R32#2 R33 R34 = 电阻
U6 = USB2514
U7#2 = TPS2061: TPS2061DGN
X1 = 表贴晶体: 4PIN表贴晶体

## Sheet 7.MINIPCIE.SchDoc
size A4
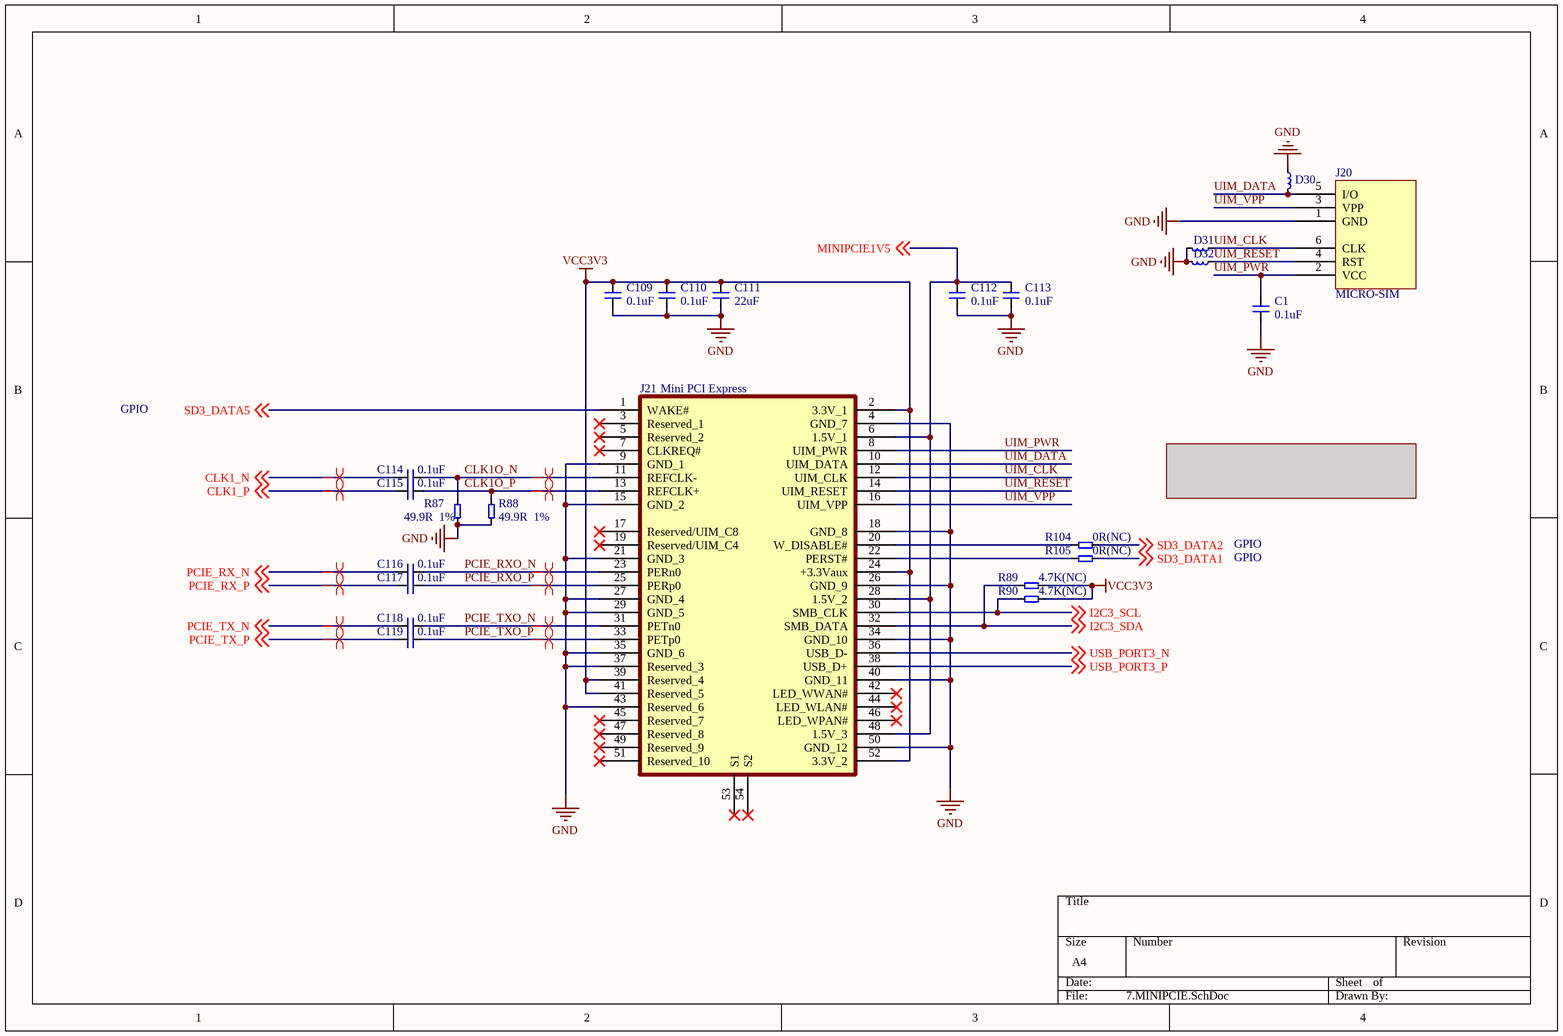
[diagram p6: 7.MINIPCIE.SchDoc]

### Parts
C1  0.1uF  [0603C]
C109  0.1uF  [0603C]
C110  0.1uF  [0603C]
C111  22uF  [0603C]
C112  0.1uF  [0603C]
C113  0.1uF  [0603C]
C114  0.1uF  [0603C]
C115  0.1uF  [0603C]
C116  0.1uF  [0603C]
C117  0.1uF  [0603C]
C118  0.1uF  [0603C]
C119  0.1uF  [0603C]
D30  ESD  [0603L]  (value not drawn)
D31  ESD  [0603L]  (value not drawn)
D32  ESD  [0603L]  (value not drawn)
J20  MICRO-SIM  [MACRO-SIM]
J21  Mini PCI Express  [MINI-PCIE]
R87  49.9R  1%  [0603R]
R88  49.9R  1%  [0603R]
R89  4.7K(NC)  [0603R]
R90  4.7K(NC)  [0603R]
R104  0R(NC)  [0603R]
R105  0R(NC)  [0603R]

### Nets
GND: C1.2 C109.2 C110.2 C111.2 C112.2 C113.2 D30.1 D31.2 D32.2 J20.1(GND) J21.4(GND_7) J21.9(GND_1) J21.15(GND_2) J21.18(GND_8) J21.21(GND_3) J21.26(GND_9) J21.27(GND_4) J21.29(GND_5) J21.34(GND_10) J21.35(GND_6) J21.37(Reserved_3) J21.40(GND_11) J21.43(Reserved_6) J21.50(GND_12) R87.1 R88.1
VCC3V3: C109.1 C110.1 C111.1 J21.2(3.3V_1) J21.24(+3.3Vaux) J21.39(Reserved_4) J21.41(Reserved_5) J21.52(3.3V_2) R89.1 R90.1
CLK1_N: C114.1 ; off-sheet CLK1_N
CLK1_P: C115.1 ; off-sheet CLK1_P
CLK1O_N: C114.2 J21.11(REFCLK-) R87.2
CLK1O_P: C115.2 J21.13(REFCLK+) R88.2
I2C3_SCL: J21.30(SMB_CLK) R90.2 ; off-sheet I2C3_SCL
I2C3_SDA: J21.32(SMB_DATA) R89.2 ; off-sheet I2C3_SDA
MINIPCIE1V5: C112.1 C113.1 J21.6(1.5V_1) J21.28(1.5V_2) J21.48(1.5V_3) ; off-sheet MINIPCIE1V5
PCIE_RX_N: C116.1 ; off-sheet PCIE_RX_N
PCIE_RX_P: C117.1 ; off-sheet PCIE_RX_P
PCIE_RXO_N: C116.2 J21.23(PERn0)
PCIE_RXO_P: C117.2 J21.25(PERp0)
PCIE_TX_N: C118.1 ; off-sheet PCIE_TX_N
PCIE_TX_P: C119.1 ; off-sheet PCIE_TX_P
PCIE_TXO_N: C118.2 J21.31(PETn0)
PCIE_TXO_P: C119.2 J21.33(PETp0)
SD3_DATA1: R105.1 ; off-sheet SD3_DATA1
SD3_DATA2: R104.1 ; off-sheet SD3_DATA2
SD3_DATA5: J21.1(WAKE#) ; off-sheet SD3_DATA5
UIM_CLK: D31.1 J20.6(CLK) J21.12(UIM_CLK)
UIM_DATA: D30.2 J20.5(I/O) J21.10(UIM_DATA)
UIM_PWR: C1.1 J20.2(VCC) J21.8(UIM_PWR)
UIM_RESET: D32.1 J20.4(RST) J21.14(UIM_RESET)
UIM_VPP: J20.3(VPP) J21.16(UIM_VPP)
USB_PORT3_N: J21.36(USB_D-) ; off-sheet USB_PORT3_N
USB_PORT3_P: J21.38(USB_D+) ; off-sheet USB_PORT3_P
NetJ21_20: J21.20(W_DISABLE#) R104.2
NetJ21_22: J21.22(PERST#) R105.2

Not connected (* = marked no-connect by the designer): J21 3(Reserved_1)* 5(Reserved_2)* 7(CLKREQ#)* 17(Reserved/UIM_C8)* 19(Reserved/UIM_C4)* 42(LED_WWAN#)* 44(LED_WLAN#)* 45(Reserved_7)* 46(LED_WPAN#)* 47(Reserved_8)* 49(Reserved_9)* 51(Reserved_10)* 53(S1)* 54(S2)*

### Layout directives
differential pair: CLK1_N, CLK1_P, CLK1O_N, CLK1O_P, PCIE_RX_N, PCIE_RX_P, PCIE_RXO_N, PCIE_RXO_P, PCIE_TX_N, PCIE_TX_P, PCIE_TXO_N, PCIE_TXO_P

### Notes on the sheet
- GPIO

### Library data of the parts
C1 C109-C119 = 电容
D30-D32 = 电感
J21 = MINIPCIE: MPC24-52K3311
R87-R90 R104 R105 = 电阻

## Sheet 10.LVDS.SchDoc
size A4
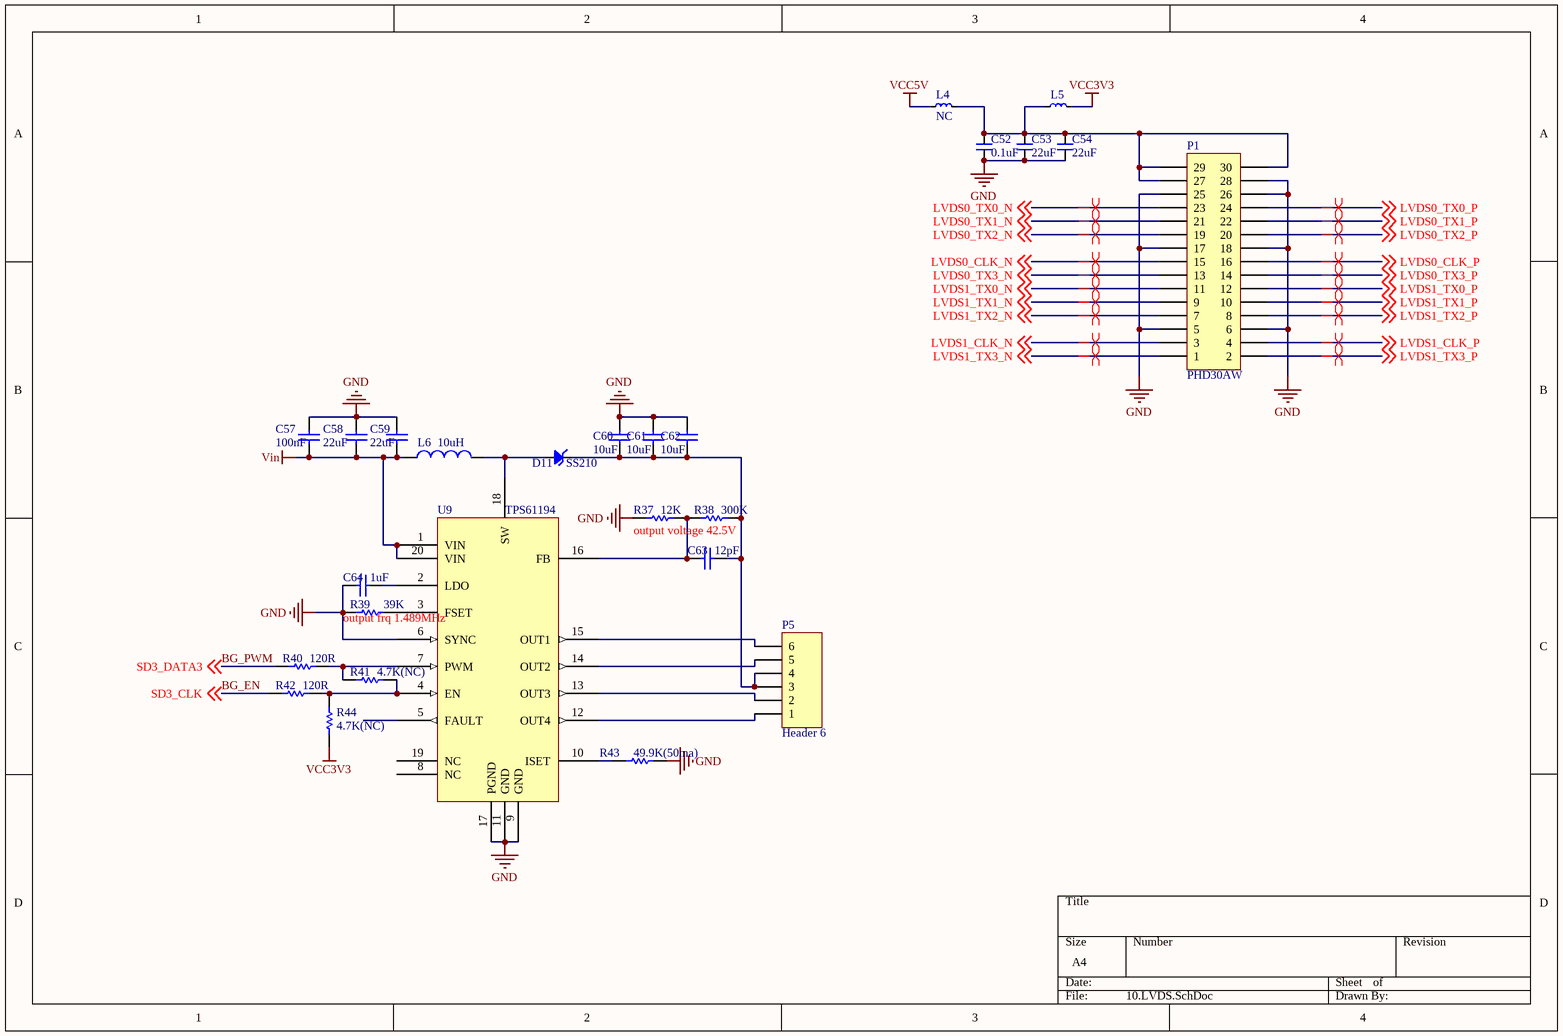
[diagram p7: 10.LVDS.SchDoc]

### Parts
C52  0.1uF  [0603C]
C53  22uF  [0603C]
C54  22uF  [0603C]
C57  100nF  [0603C]
C58  22uF  [C1206]
C59  22uF  [C1206]
C60  10uF  [C1206]
C61  10uF  [C1206]
C62  10uF  [C1206]
C63  12pF  [0603C]
C64  1uF  [0603C]
D11  SS210  [SMA]
L4  NC  [0805L]
L5  电感  [0805L]  (value not drawn)
L6  10uH  [L-6045]
P1  PHD30AW  [2.0-15P*2]
P5  Header 6  [1.25mm-6P]
R37  12K  [0603R]
R38  300K  [0603R]
R39  39K  [0603R]
R40  120R  [0603R]
R41  4.7K(NC)  [0603R]
R42  120R  [0603R]
R43  49.9K(50ma)  [0603R]
R44  4.7K(NC)  [0603R]
U9  TPS61194  [HTTSOP-20]

### Nets
EARTH: P5.0
GND: C52.2 C53.1 C54.1 C57.2 C58.1 C59.1 C60.1 C61.1 C62.1 C64.1 P1.5 P1.6 P1.17 P1.18 P1.25 P1.26 P1.28 R37.1 R39.1 R43.2 U9.6(SYNC) U9.9(GND) U9.11(GND) U9.17(PGND) U9.21(PAD)
VCC3V3: L5.2 R44.2
VCC5V: L4.1
Vin: C57.1 C58.2 C59.2 L6.1 U9.1(VIN) U9.20(VIN)
BG_EN: R42.2 ; off-sheet SD3_CLK  [also labelled SD3_CLK]
BG_PWM: R40.2 ; off-sheet SD3_DATA3  [also labelled SD3_DATA3]
LVDS0_CLK_N: P1.15 ; off-sheet LVDS0_CLK_N
LVDS0_CLK_P: P1.16 ; off-sheet LVDS0_CLK_P
LVDS0_TX0_N: P1.23 ; off-sheet LVDS0_TX0_N
LVDS0_TX0_P: P1.24 ; off-sheet LVDS0_TX0_P
LVDS0_TX1_N: P1.21 ; off-sheet LVDS0_TX1_N
LVDS0_TX1_P: P1.22 ; off-sheet LVDS0_TX1_P
LVDS0_TX2_N: P1.19 ; off-sheet LVDS0_TX2_N
LVDS0_TX2_P: P1.20 ; off-sheet LVDS0_TX2_P
LVDS0_TX3_N: P1.13 ; off-sheet LVDS0_TX3_N
LVDS0_TX3_P: P1.14 ; off-sheet LVDS0_TX3_P
LVDS1_CLK_N: P1.3 ; off-sheet LVDS1_CLK_N
LVDS1_CLK_P: P1.4 ; off-sheet LVDS1_CLK_P
LVDS1_TX0_N: P1.11 ; off-sheet LVDS1_TX0_N
LVDS1_TX0_P: P1.12 ; off-sheet LVDS1_TX0_P
LVDS1_TX1_N: P1.9 ; off-sheet LVDS1_TX1_N
LVDS1_TX1_P: P1.10 ; off-sheet LVDS1_TX1_P
LVDS1_TX2_N: P1.7 ; off-sheet LVDS1_TX2_N
LVDS1_TX2_P: P1.8 ; off-sheet LVDS1_TX2_P
LVDS1_TX3_N: P1.1 ; off-sheet LVDS1_TX3_N
LVDS1_TX3_P: P1.2 ; off-sheet LVDS1_TX3_P
NetC52_1: C52.1 C53.2 C54.2 L4.2 L5.1 P1.27 P1.29 P1.30
NetC60_2: C60.2 C61.2 C62.2 C63.2 D11.K P5.3 P5.4 R38.2
NetC63_1: C63.1 R37.2 R38.1 U9.16(FB)
NetC64_2: C64.2 U9.2(LDO)
NetD11_A: D11.A L6.2 U9.18(SW)
NetP5_1: P5.1 U9.12(OUT4)
NetP5_2: P5.2 U9.13(OUT3)
NetP5_5: P5.5 U9.14(OUT2)
NetP5_6: P5.6 U9.15(OUT1)
NetR39_2: R39.2 U9.3(FSET)
NetR40_1: R40.1 R41.1 U9.7(PWM)
NetR41_2: R41.2 R42.1 R44.1 U9.4(EN)
NetR43_1: R43.1 U9.10(ISET)

Not connected (* = marked no-connect by the designer): U9 5(FAULT) 8(NC) 19(NC)

### Layout directives
differential pair: LVDS0_CLK_N, LVDS0_CLK_P, LVDS0_TX0_N, LVDS0_TX0_P, LVDS0_TX1_N, LVDS0_TX1_P, LVDS0_TX2_N, LVDS0_TX2_P, LVDS0_TX3_N, LVDS0_TX3_P, LVDS1_CLK_N, LVDS1_CLK_P, LVDS1_TX0_N, LVDS1_TX0_P, LVDS1_TX1_N, LVDS1_TX1_P, LVDS1_TX2_N, LVDS1_TX2_P, LVDS1_TX3_N, LVDS1_TX3_P

### Notes on the sheet
- output voltage 42.5V
- output frq 1.489MHz

### Library data of the parts
C52-C54 = 电容
C57-C64 = Cap: 电容; Published: 8-Jun-2000; LatestRevisionDate: 17-Jul-2002; LatestRevisionNote: Re-released for DXP Platform.; PackageReference: RAD-0.3; Publisher: Altium Limited
  C57: Value: 100nF
  C58 C59: Value: 22uF
  C60-C62: Value: 10uF
  C63: Value: 12pF
  C64: Value: 1uF
D11 = SS24: 肖特基二极管; DIODES: *
L4 = 电感
L6 = Inductor: 功率电感; Code_IEC: 1005; Published: 8-Jun-2000; LatestRevisionDate: 17-Jul-2002; LatestRevisionNote: Re-released for DXP Platform.; PackageReference: 0402-A; Publisher: Altium Limited; Code_JEITA: 0402; Value: 10uH
P1 = Header 15X2: Header, 15-Pin, Dual row; LatestRevisionDate: 17-Jul-2002; LatestRevisionNote: Re-released for DXP Platform.; Publisher: Altium Limited
P5 = Header 6: Header, 6-Pin; LatestRevisionDate: 17-Jul-2002; LatestRevisionNote: Re-released for DXP Platform.; Publisher: Altium Limited
R37-R42 R44 = Res1: 电阻; Published: 8-Jun-2000; LatestRevisionDate: 17-Jul-2002; LatestRevisionNote: Re-released for DXP Platform.; PackageReference: AXIAL-0.3; Publisher: Altium Limited
  R37: Value: 12K
  R38: Value: 300K
  R39: Value: 39K
  R40 R42: Value: 120R
  R41 R44: Value: 4.7K(NC)
R43 = Res1: 电阻; Value: 47K (50ma); Published: 8-Jun-2000; LatestRevisionDate: 17-Jul-2002; LatestRevisionNote: Re-released for DXP Platform.; PackageReference: AXIAL-0.3; Publisher: Altium Limited

## Sheet 11.EX-MODULE.SchDoc
size A3
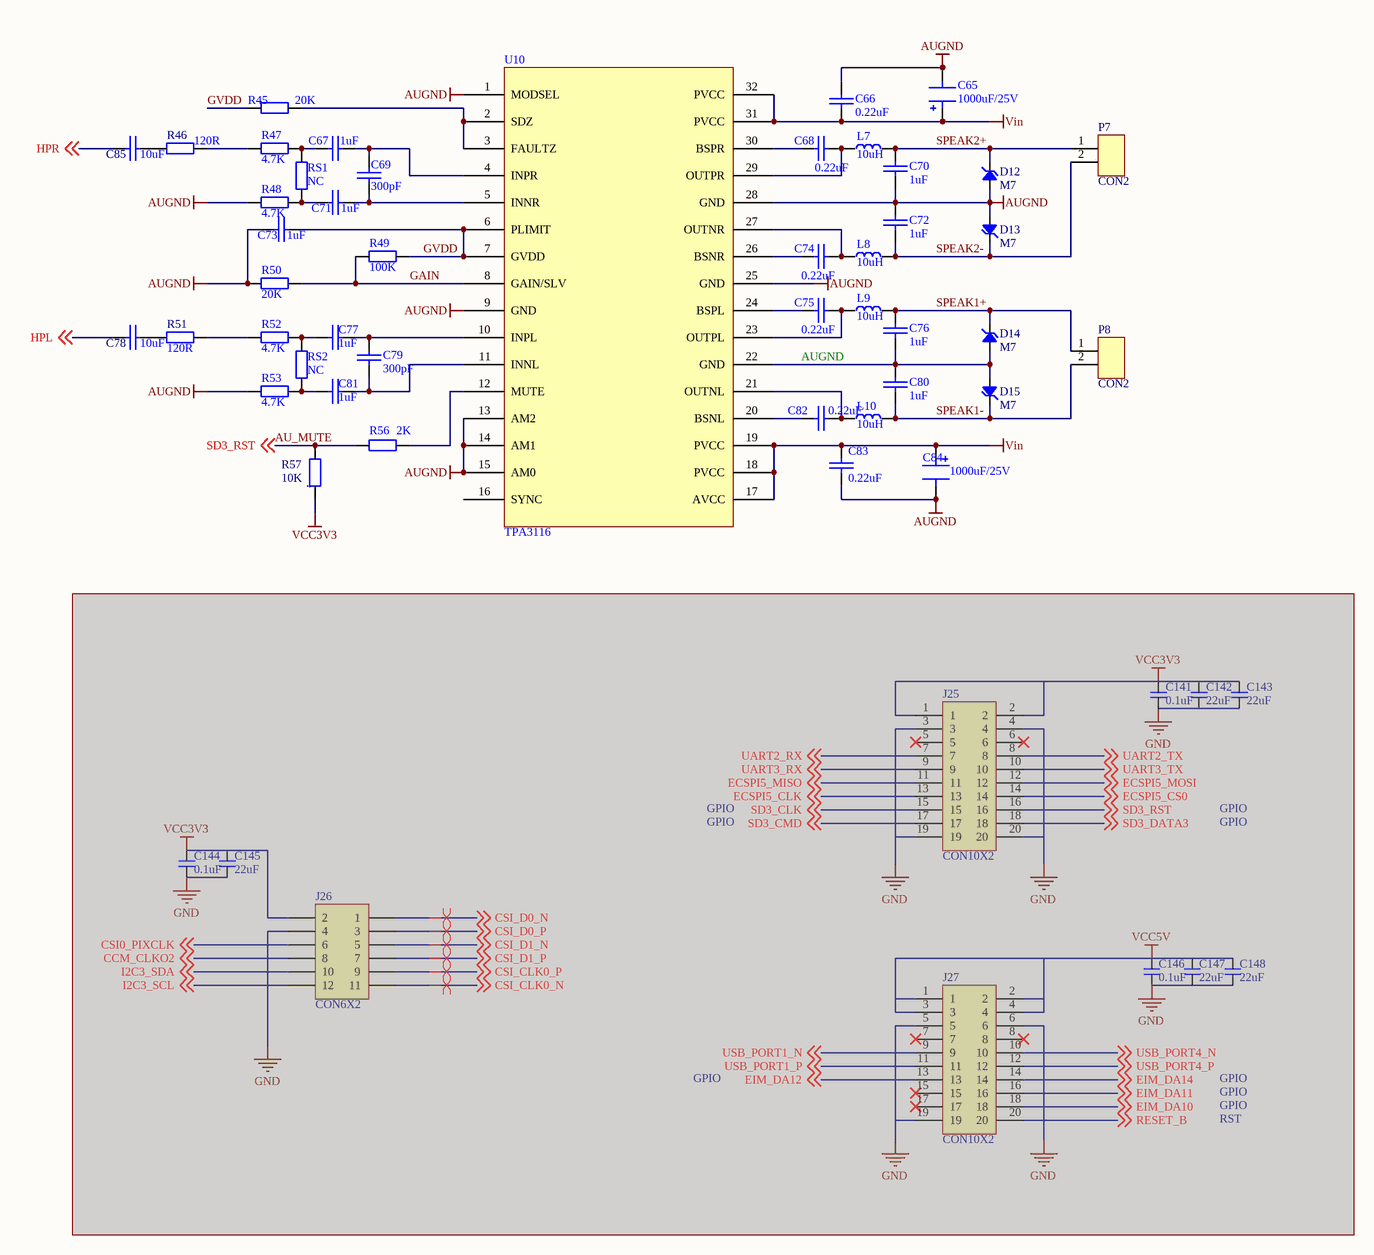
[diagram p8: 11.EX-MODULE.SchDoc]

### Parts
(Parts that share a designator on the sheet are numbered #1, #2 ... from top to bottom, then left to right.)
C65  1000uF/25V  [C10-SMD]
C66  0.22uF  [0603C]
C67  1uF  [0603C]
C68  0.22uF  [0603C]
C69  300pF  [0603C]
C70  1uF  [0603C]
C71  1uF  [0603C]
C72  1uF  [0603C]
C73  1uF  [0603C]
C74  0.22uF  [0603C]
C75  0.22uF  [0603C]
C76  1uF  [0603C]
C77  1uF  [0603C]
C78#2  10uF  [0603C]
C79#2  300pF  [0603C]
C80#2  1uF  [0603C]
C81  1uF  [0603C]
C82  0.22uF  [0603C]
C83  0.22uF  [0603C]
C84  1000uF/25V  [C10-SMD]
C85  10uF  [0603C]
C141  0.1uF  [0603C]  (masked out: inside a compile mask, not in the netlist)
C142  22uF  [0805C]  (masked out: inside a compile mask, not in the netlist)
C143  22uF  [0805C]  (masked out: inside a compile mask, not in the netlist)
C144  0.1uF  [0603C]  (masked out: inside a compile mask, not in the netlist)
C145  22uF  [0805C]  (masked out: inside a compile mask, not in the netlist)
C146  0.1uF  [0603C]  (masked out: inside a compile mask, not in the netlist)
C147  22uF  [0805C]  (masked out: inside a compile mask, not in the netlist)
C148  22uF  [0805C]  (masked out: inside a compile mask, not in the netlist)
D12  M7  [SMA]
D13  M7  [SMA]
D14  M7  [SMA]
D15  M7  [SMA]
J25  CON10X2  [IDC10X2-2.54MM]  (masked out: inside a compile mask, not in the netlist)
J26  CON6X2  [IDC6X2-2.54MM]  (masked out: inside a compile mask, not in the netlist)
J27  CON10X2  [IDC10X2-2.54MM]  (masked out: inside a compile mask, not in the netlist)
L7  10uH  [L-6045]
L8  10uH  [L-6045]
L9  10uH  [L-6045]
L10  10uH  [L-6045]
P7  CON2  [VH3.96-2P-SMT]
P8  CON2  [VH3.96-2P-SMT]
R45  20K  [0603R]
R46  120R  [0603R]
R47  4.7K  [0603R]
R48  4.7K  [0603R]
R49  100K  [0603R]
R50  20K  [0603R]
R51  120R  [0603R]
R52  4.7K  [0603R]
R53#2  4.7K  [0603R]
R56#2  2K  [0603R]
R57  10K  [0603R]
RS1  NC  [0603R]
RS2  NC  [0603R]
U10  TPA3116  [HTSSOP-32]

### Nets
AUGND: C65.2 C66.2 C70.1 C72.2 C73.1 C76.1 C80#2.2 C83.2 C84.2 D12.A D13.A D14.A D15.A R48.2 R50.2 R53#2.2 U10.1(MODSEL) U10.9(GND) U10.13(AM2) U10.14(AM1) U10.15(AM0) U10.22(GND) U10.25(GND) U10.28(GND) U10.33
EARTH: P7.0 P8.0
VCC3V3: R57.1
Vin: C65.1 C66.1 C83.1 C84.1 U10.17(AVCC) U10.18(PVCC) U10.19(PVCC) U10.31(PVCC) U10.32(PVCC)
AU_MUTE: R56#2.1 R57.2 ; off-sheet SD3_RST  [also labelled SD3_RST]
GAIN: R49.1 R50.1 U10.8(GAIN/SLV)
GVDD: C73.2 R45.1 R49.2 U10.6(PLIMIT) U10.7(GVDD)
HPL: C78#2.1 ; off-sheet HPL
HPR: C85.1 ; off-sheet HPR
SPEAK1+: C76.2 D14.K L9.2 P8.1
SPEAK1-: C80#2.1 D15.K L10.2 P8.2
SPEAK2+: C70.2 D12.K L7.2 P7.1
SPEAK2-: C72.1 D13.K L8.2 P7.2
NetC67_1: C67.1 R47.1 RS1.1
NetC67_2: C67.2 C69.1 U10.4(INPR)
NetC68_1: C68.1 U10.30(BSPR)
NetC68_2: C68.2 L7.1 U10.29(OUTPR)
NetC69_2: C69.2 C71.2 U10.5(INNR)
NetC71_1: C71.1 R48.1 RS1.2
NetC74_1: C74.1 U10.26(BSNR)
NetC74_2: C74.2 L8.1 U10.27(OUTNR)
NetC75_1: C75.1 U10.24(BSPL)
NetC75_2: C75.2 L9.1 U10.23(OUTPL)
NetC77_1: C77.1 R52.1 RS2.1
NetC77_2: C77.2 C79#2.1 U10.10(INPL)
NetC78#2_2: C78#2.2 R51.1
NetC79#2_2: C79#2.2 C81.2 U10.11(INNL)
NetC81_1: C81.1 R53#2.1 RS2.2
NetC82_1: C82.1 U10.20(BSNL)
NetC82_2: C82.2 L10.1 U10.21(OUTNL)
NetC85_2: C85.2 R46.1
NetR45_2: R45.2 U10.2(SDZ) U10.3(FAULTZ)
NetR46_2: R46.2 R47.2
NetR51_2: R51.2 R52.2
NetR56#2_2: R56#2.2 U10.12(MUTE)

Not connected (* = marked no-connect by the designer): U10 16(SYNC)

### Layout directives
differential pair: (no net found under the mark)

### Notes on the sheet
- GPIO
- RST

### Library data of the parts
C65 C84 = ELECTRO
C66-C77 C78#2 C79#2 C80#2 C81-C83 C85 = CAP
C141-C148 = 电容
D12-D15 = SS24: DIODES: *
J26 = Header 6X2: Header, 6-Pin, Dual row; LatestRevisionDate: 17-Jul-2002; LatestRevisionNote: Re-released for DXP Platform.; Publisher: Altium Limited
L7-L10 = INCLUDE
R45-R50 R52 R53#2 R56#2 R57 RS1 RS2 = RES
R51 = RES: 电阻
U10 = TPA3116D2

## Sheet 12.WTD&RTC.SchDoc
size A4
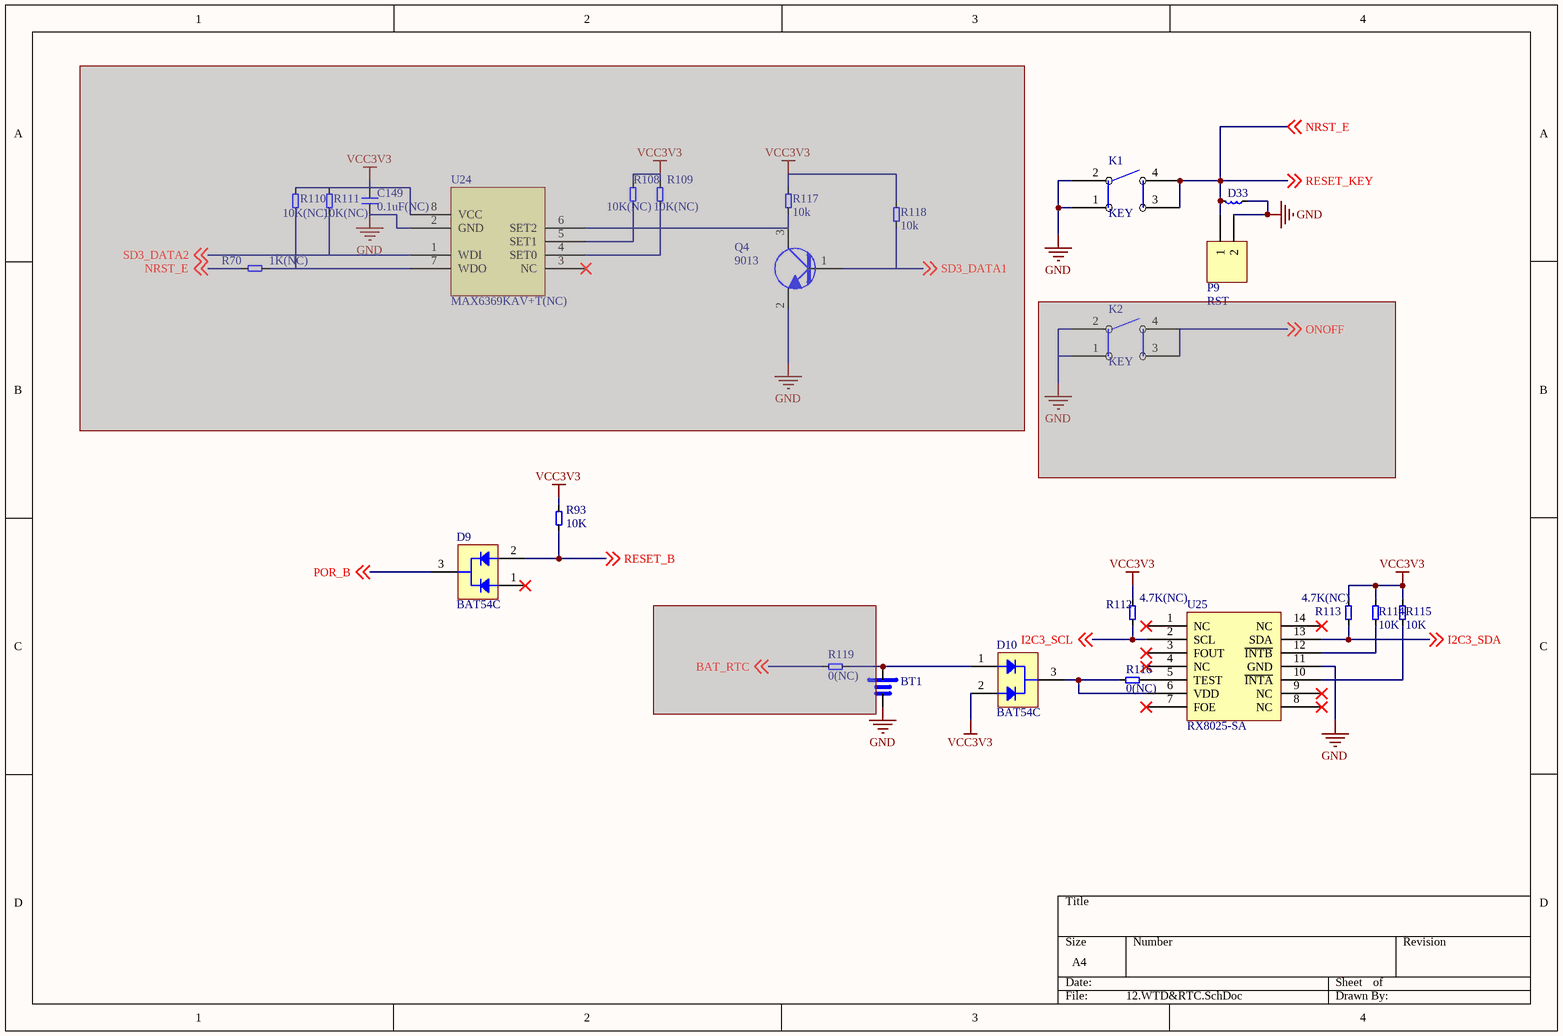
[diagram p9: 12.WTD&RTC.SchDoc]

### Parts
BT1  (no value)  [CR1220]
C149  0.1uF(NC)  [0603C]  (masked out: inside a compile mask, not in the netlist)
D9  BAT54C  [SOT-23]
D10  BAT54C  [SOT-23]
D33  ESD  [0603L]  (value not drawn)
K1  KEY  [SS-SPB-4.5]
K2  KEY  [SS-SPB-4.5]  (masked out: inside a compile mask, not in the netlist)
P9  RST  [PH2.0-2-SMT]
Q4  9013  [SOT-23]  (masked out: inside a compile mask, not in the netlist)
R70  1K(NC)  [0603R]  (masked out: inside a compile mask, not in the netlist)
R93  10K  [0603R]
R108  10K(NC)  [0603R]  (masked out: inside a compile mask, not in the netlist)
R109  10K(NC)  [0603R]  (masked out: inside a compile mask, not in the netlist)
R110  10K(NC)  [0603R]  (masked out: inside a compile mask, not in the netlist)
R111  10K(NC)  [0603R]  (masked out: inside a compile mask, not in the netlist)
R112  4.7K(NC)  [0603R]
R113  4.7K(NC)  [0603R]
R114  10K  [0603R]
R115  10K  [0603R]
R116  0(NC)  [0603R]
R117  10k  [0603R]  (masked out: inside a compile mask, not in the netlist)
R118  10k  [0603R]  (masked out: inside a compile mask, not in the netlist)
R119  0(NC)  [0603R]  (masked out: inside a compile mask, not in the netlist)
U24  MAX6369KAV+T(NC)  [TSOT23-8]  (masked out: inside a compile mask, not in the netlist)
U25  RX8025-SA  [SOP14-1.27]

### Nets
EARTH: P9.0
GND: BT1.2 D33.1 K1.1 K1.2 P9.2 U25.11(GND)
VCC3V3: D10.2 R93.2 R112.2 R113.2 R114.2 R115.2
I2C3_SCL: R112.1 U25.2(SCL) ; off-sheet I2C3_SCL
I2C3_SDA: R113.1 U25.13(SDA) ; off-sheet I2C3_SDA
NRST_E: D33.2 K1.3 K1.4 P9.1 ; off-sheet RESET_KEY, off-sheet NRST_E  [also labelled RESET_KEY]
POR_B: D9.3 ; off-sheet POR_B
RESET_B: D9.2 R93.1 ; off-sheet RESET_B
NetBT1_1: BT1.1 D10.1
NetD10_3: D10.3 R116.2 U25.6(VDD)
NetR114_1: R114.1 U25.12(~{INTB})
NetR115_1: R115.1 U25.10(~{INTA})
NetR116_1: R116.1 U25.5(TEST)

Not connected (* = marked no-connect by the designer): D9 1*; U25 1(NC)* 3(FOUT)* 4(NC)* 7(FOE)* 8(NC)* 9(NC)* 14(NC)*

### Library data of the parts
BT1 = 电池
C149 = 电容
D9 D10 = BAT54C: SCHOTTKY DIODE
D33 = 电感
K1 K2 = 按键
P9 = Header 2: Header, 2-Pin; LatestRevisionDate: 17-Jul-2002; LatestRevisionNote: Re-released for DXP Platform.; Publisher: Altium Limited
R70 R93 R108-R119 = 电阻
U24 = MAX6369KAV+T
U25 = RX8025-SA: I2C interface RTC with crystal built-in

## Nets that join several sheets
AUGND: 0.CONNECTOR (J2.98), 1.POWER (L2.2), 11.EX-MODULE (25 pins)
EARTH: 1.POWER (L3.2 P4.0), 2.ETH (J5.15 J5.16), 3.UART (J3.BO1 J3.BO2 J6.BO1 J6.BO2), 5.USB (12 pins), 10.LVDS (P5.0), 11.EX-MODULE (P7.0 P8.0), 12.WTD&RTC (P9.0)
GND: 0.CONNECTOR (16 pins), 1.POWER (24 pins), 2.ETH (C19.2 Q1.3 Q2.3), 3.UART (17 pins), 4.CAN (9 pins), 5.USB (42 pins), 7.MINIPCIE (26 pins), 10.LVDS (25 pins), 12.WTD&RTC (6 pins)
VCC3V3: 1.POWER (6 pins), 2.ETH (R10.2 R11.2), 3.UART (C7.2 C25.2 U5.16 U8.16), 5.USB (15 pins), 7.MINIPCIE (10 pins), 10.LVDS (L5.2 R44.2), 11.EX-MODULE (R57.1), 12.WTD&RTC (6 pins)
VCC5V: 0.CONNECTOR (5 pins), 1.POWER (8 pins), 3.UART (C23.1 R17.1 U3.8 U4.5), 4.CAN (C12.1 U7#1.3), 5.USB (5 pins), 10.LVDS (L4.1)
Vin: 1.POWER (5 pins), 4.CAN (P10.4), 10.LVDS (6 pins), 11.EX-MODULE (9 pins)
485_A: 1.POWER (P2.3), 3.UART (D17.2 R16.1 R17.2 U3.6)
485_B: 1.POWER (P2.1), 3.UART (D16.2 R15.1 R16.2 U3.7)
AU_MUTE: 0.CONNECTOR (J1.71), 11.EX-MODULE (R56#2.1 R57.2)
BG_EN: 0.CONNECTOR (J1.73), 10.LVDS (R42.2)
BG_PWM: 0.CONNECTOR (J1.75), 10.LVDS (R40.2)
CAN1_RX: 0.CONNECTOR (J2.12), 4.CAN (R7.1 R12.2)
CAN1_TX: 0.CONNECTOR (J2.10), 4.CAN (U7#1.1)
CLK1_N: 0.CONNECTOR (J2.83), 7.MINIPCIE (C114.1)
CLK1_P: 0.CONNECTOR (J2.81), 7.MINIPCIE (C115.1)
HPL: 0.CONNECTOR (J2.97), 11.EX-MODULE (C78#2.1)
HPR: 0.CONNECTOR (J2.99), 11.EX-MODULE (C85.1)
I2C3_SCL: 0.CONNECTOR (J2.13), 7.MINIPCIE (J21.30 R90.2), 12.WTD&RTC (R112.1 U25.2)
I2C3_SDA: 0.CONNECTOR (J2.11), 7.MINIPCIE (J21.32 R89.2), 12.WTD&RTC (R113.1 U25.13)
LED_ACT: 0.CONNECTOR (J1.92), 2.ETH (J5.13)
LED_LINK10_100: 0.CONNECTOR (J1.91), 2.ETH (R14.2)
LED_LINK1000: 0.CONNECTOR (J1.90), 2.ETH (R13.2)
LVDS0_CLK_N: 0.CONNECTOR (J2.14), 10.LVDS (P1.15)
LVDS0_CLK_P: 0.CONNECTOR (J2.16), 10.LVDS (P1.16)
LVDS0_TX0_N: 0.CONNECTOR (J2.30), 10.LVDS (P1.23)
LVDS0_TX0_P: 0.CONNECTOR (J2.32), 10.LVDS (P1.24)
LVDS0_TX1_N: 0.CONNECTOR (J2.18), 10.LVDS (P1.21)
LVDS0_TX1_P: 0.CONNECTOR (J2.20), 10.LVDS (P1.22)
LVDS0_TX2_N: 0.CONNECTOR (J2.26), 10.LVDS (P1.19)
LVDS0_TX2_P: 0.CONNECTOR (J2.28), 10.LVDS (P1.20)
LVDS0_TX3_N: 0.CONNECTOR (J2.22), 10.LVDS (P1.13)
LVDS0_TX3_P: 0.CONNECTOR (J2.24), 10.LVDS (P1.14)
LVDS1_CLK_N: 0.CONNECTOR (J2.33), 10.LVDS (P1.3)
LVDS1_CLK_P: 0.CONNECTOR (J2.31), 10.LVDS (P1.4)
LVDS1_TX0_N: 0.CONNECTOR (J2.29), 10.LVDS (P1.11)
LVDS1_TX0_P: 0.CONNECTOR (J2.27), 10.LVDS (P1.12)
LVDS1_TX1_N: 0.CONNECTOR (J2.23), 10.LVDS (P1.9)
LVDS1_TX1_P: 0.CONNECTOR (J2.25), 10.LVDS (P1.10)
LVDS1_TX2_N: 0.CONNECTOR (J2.21), 10.LVDS (P1.7)
LVDS1_TX2_P: 0.CONNECTOR (J2.19), 10.LVDS (P1.8)
LVDS1_TX3_N: 0.CONNECTOR (J2.17), 10.LVDS (P1.1)
LVDS1_TX3_P: 0.CONNECTOR (J2.15), 10.LVDS (P1.2)
MINIPCIE1V5: 0.CONNECTOR (J2.8), 7.MINIPCIE (5 pins)
NRST_E: 0.CONNECTOR (J2.95), 12.WTD&RTC (D33.2 K1.3 K1.4 P9.1)
PCIE_RX_N: 0.CONNECTOR (J2.75), 7.MINIPCIE (C116.1)
PCIE_RX_P: 0.CONNECTOR (J2.73), 7.MINIPCIE (C117.1)
PCIE_TX_N: 0.CONNECTOR (J2.79), 7.MINIPCIE (C118.1)
PCIE_TX_P: 0.CONNECTOR (J2.77), 7.MINIPCIE (C119.1)
POR_B: 0.CONNECTOR (J2.35), 12.WTD&RTC (D9.3)
SD3_DATA1: 0.CONNECTOR (J1.74), 7.MINIPCIE (R105.1)
SD3_DATA2: 0.CONNECTOR (J1.76), 7.MINIPCIE (R104.1)
SD3_DATA5: 0.CONNECTOR (J1.78), 7.MINIPCIE (J21.1)
TRX0_N: 0.CONNECTOR (J1.100), 2.ETH (J5.2)
TRX0_P: 0.CONNECTOR (J1.98), 2.ETH (J5.1)
TRX1_N: 0.CONNECTOR (J1.96), 2.ETH (J5.4)
TRX1_P: 0.CONNECTOR (J1.94), 2.ETH (J5.3)
TRX2_N: 0.CONNECTOR (J1.97), 2.ETH (J5.8)
TRX2_P: 0.CONNECTOR (J1.99), 2.ETH (J5.7)
TRX3_N: 0.CONNECTOR (J1.93), 2.ETH (J5.10)
TRX3_P: 0.CONNECTOR (J1.95), 2.ETH (J5.9)
UART1_RX: 0.CONNECTOR (J2.84), 3.UART (U8.9)
UART1_TX: 0.CONNECTOR (J2.86), 3.UART (U8.10)
UART2_RX: 0.CONNECTOR (J1.31), 3.UART (U5.9)
UART2_TX: 0.CONNECTOR (J1.29), 3.UART (U5.10)
UART3_RX: 0.CONNECTOR (J1.34), 3.UART (U3.1)
UART3_TX: 0.CONNECTOR (J1.36), 3.UART (D4.3 R18.2 U3.4)
USB_H1_D_N: 0.CONNECTOR (J2.91), 5.USB (U6.30)
USB_H1_D_P: 0.CONNECTOR (J2.93), 5.USB (U6.31)
USB_OTG_D_N: 0.CONNECTOR (J2.89), 5.USB (R33.2)
USB_OTG_D_P: 0.CONNECTOR (J2.87), 5.USB (R34.2)
USB_OTG_ID: 0.CONNECTOR (J2.88), 5.USB (J9.4)
USB_OTG_VBUS: 0.CONNECTOR (J2.85), 5.USB (C47.2 C48.2 C49.2 J9.1)
USB_PORT3_N: 5.USB (D27.2 J8.6 U6.6), 7.MINIPCIE (J21.36)
USB_PORT3_P: 5.USB (D29.2 J8.7 U6.7), 7.MINIPCIE (J21.38)